# EAGLE design untitled (EAGLE 7.2.0)
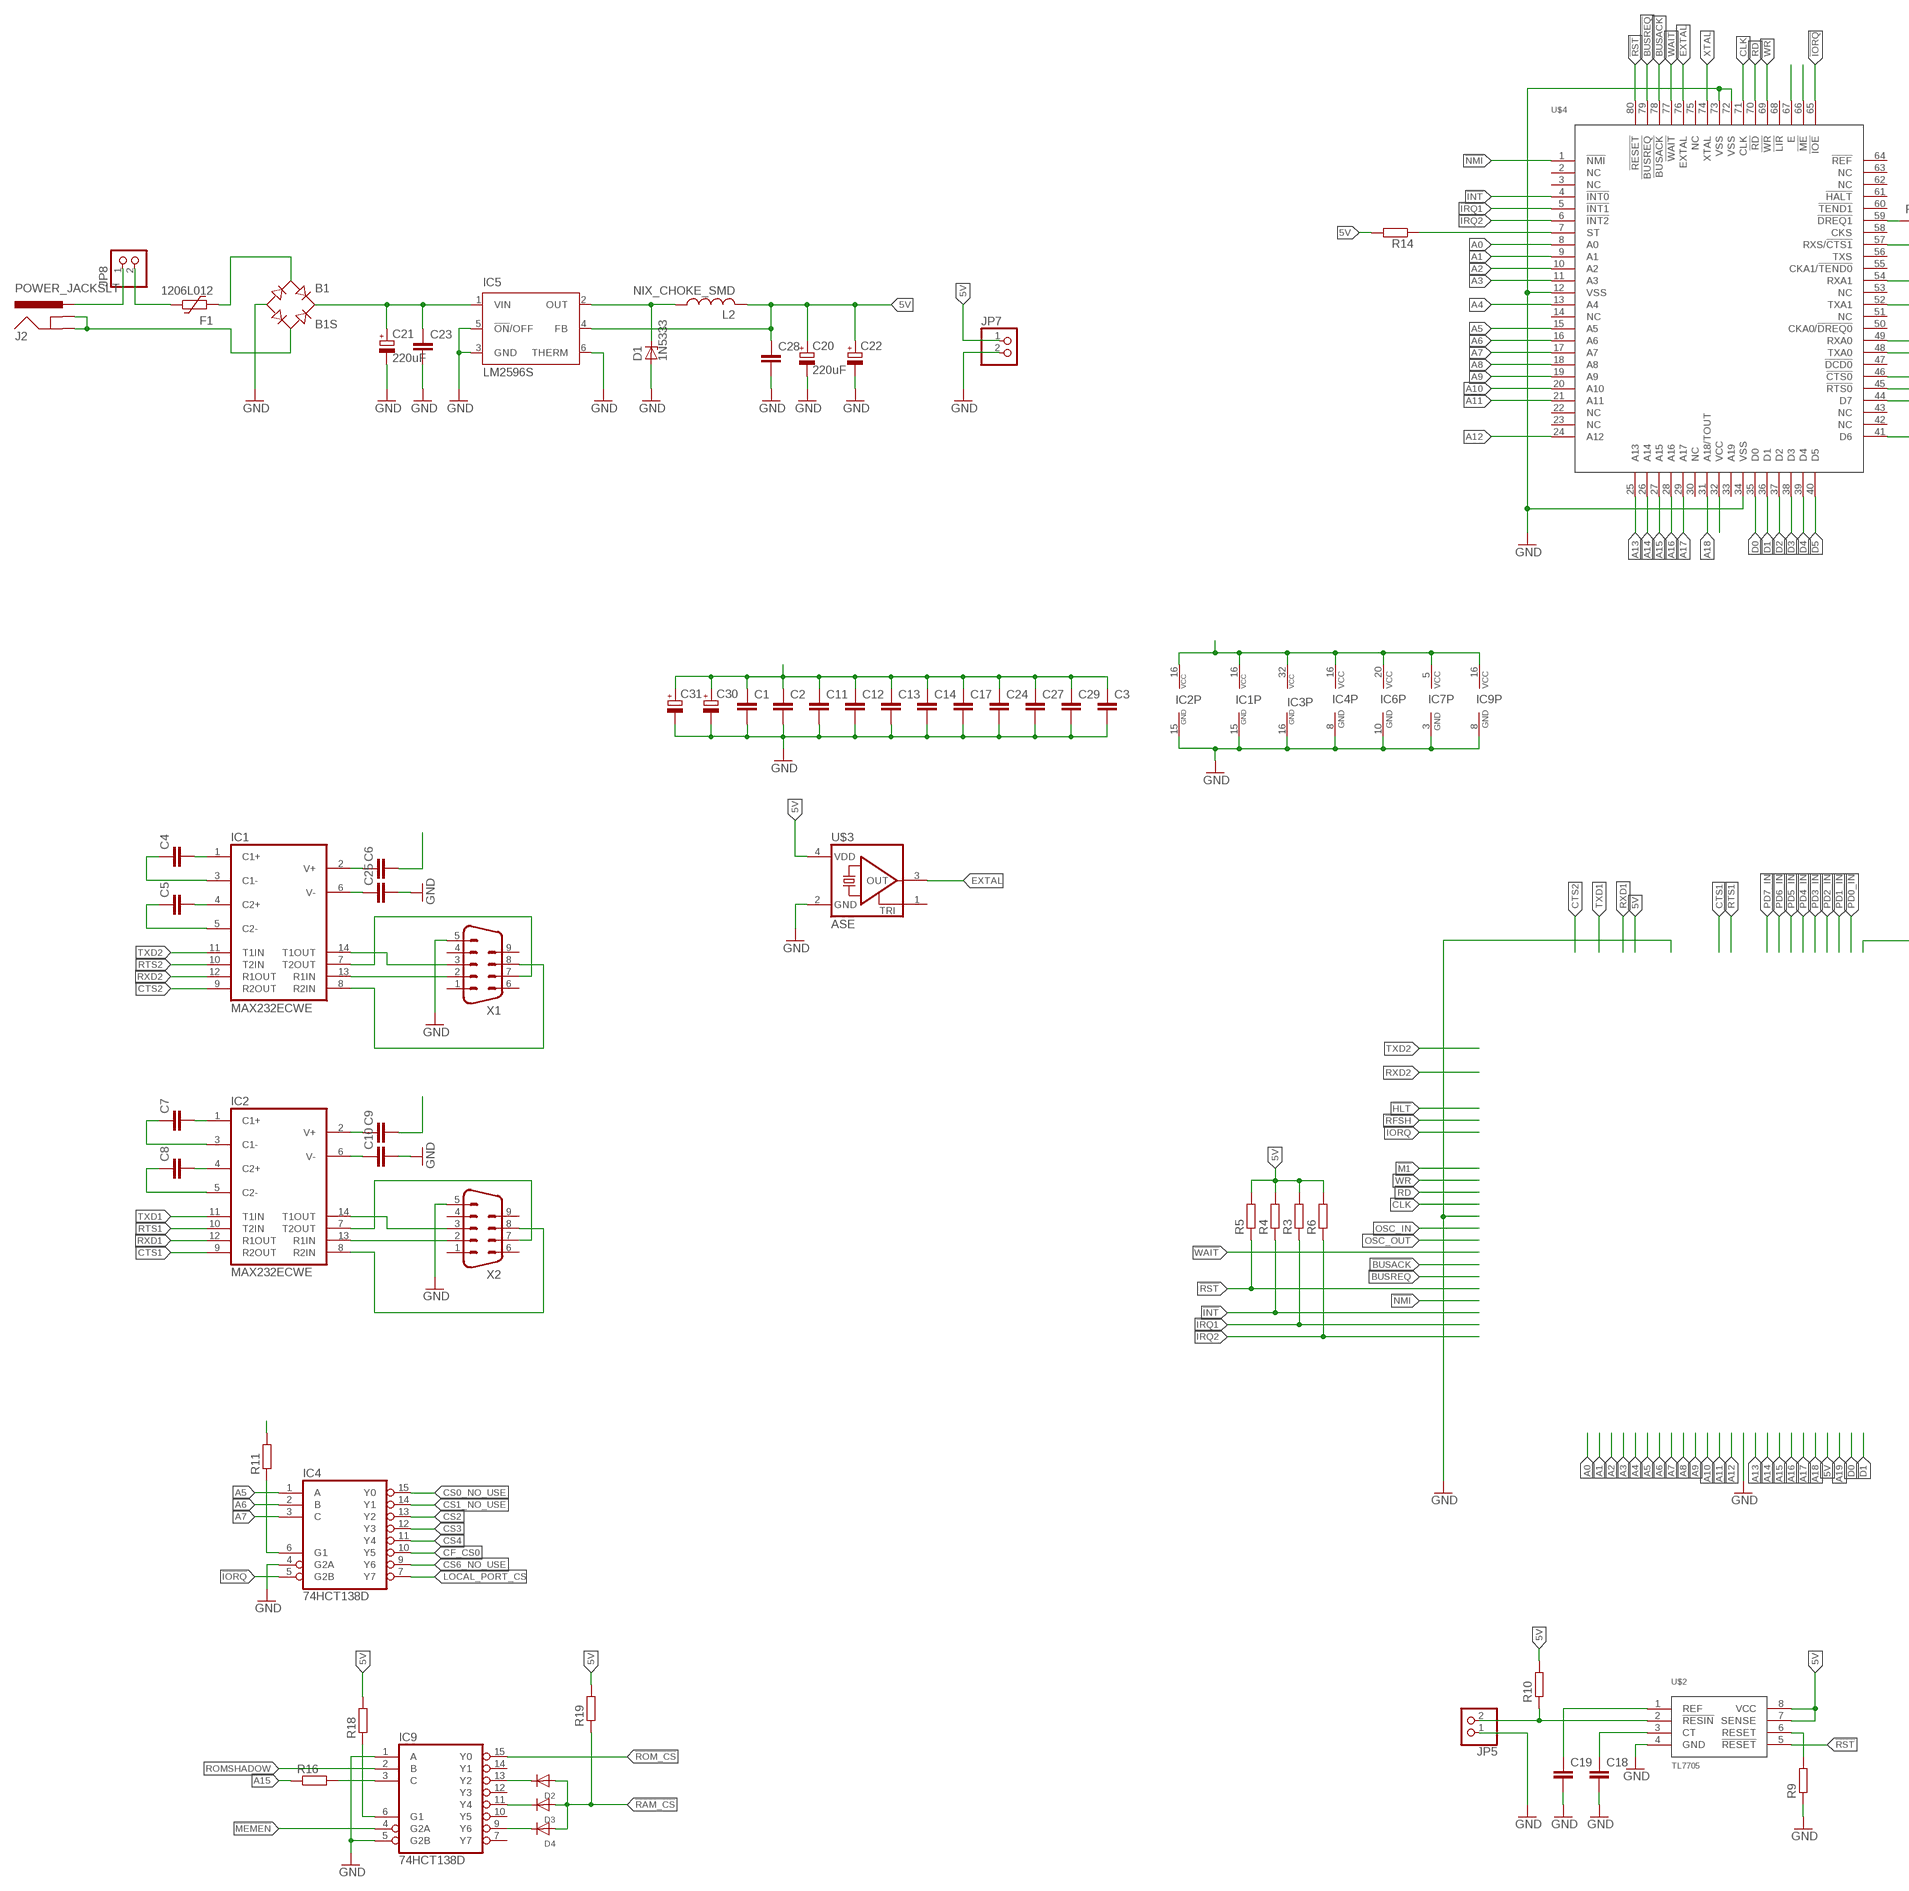
[diagram p0: schematic, sheet 1, part 1 of 2]
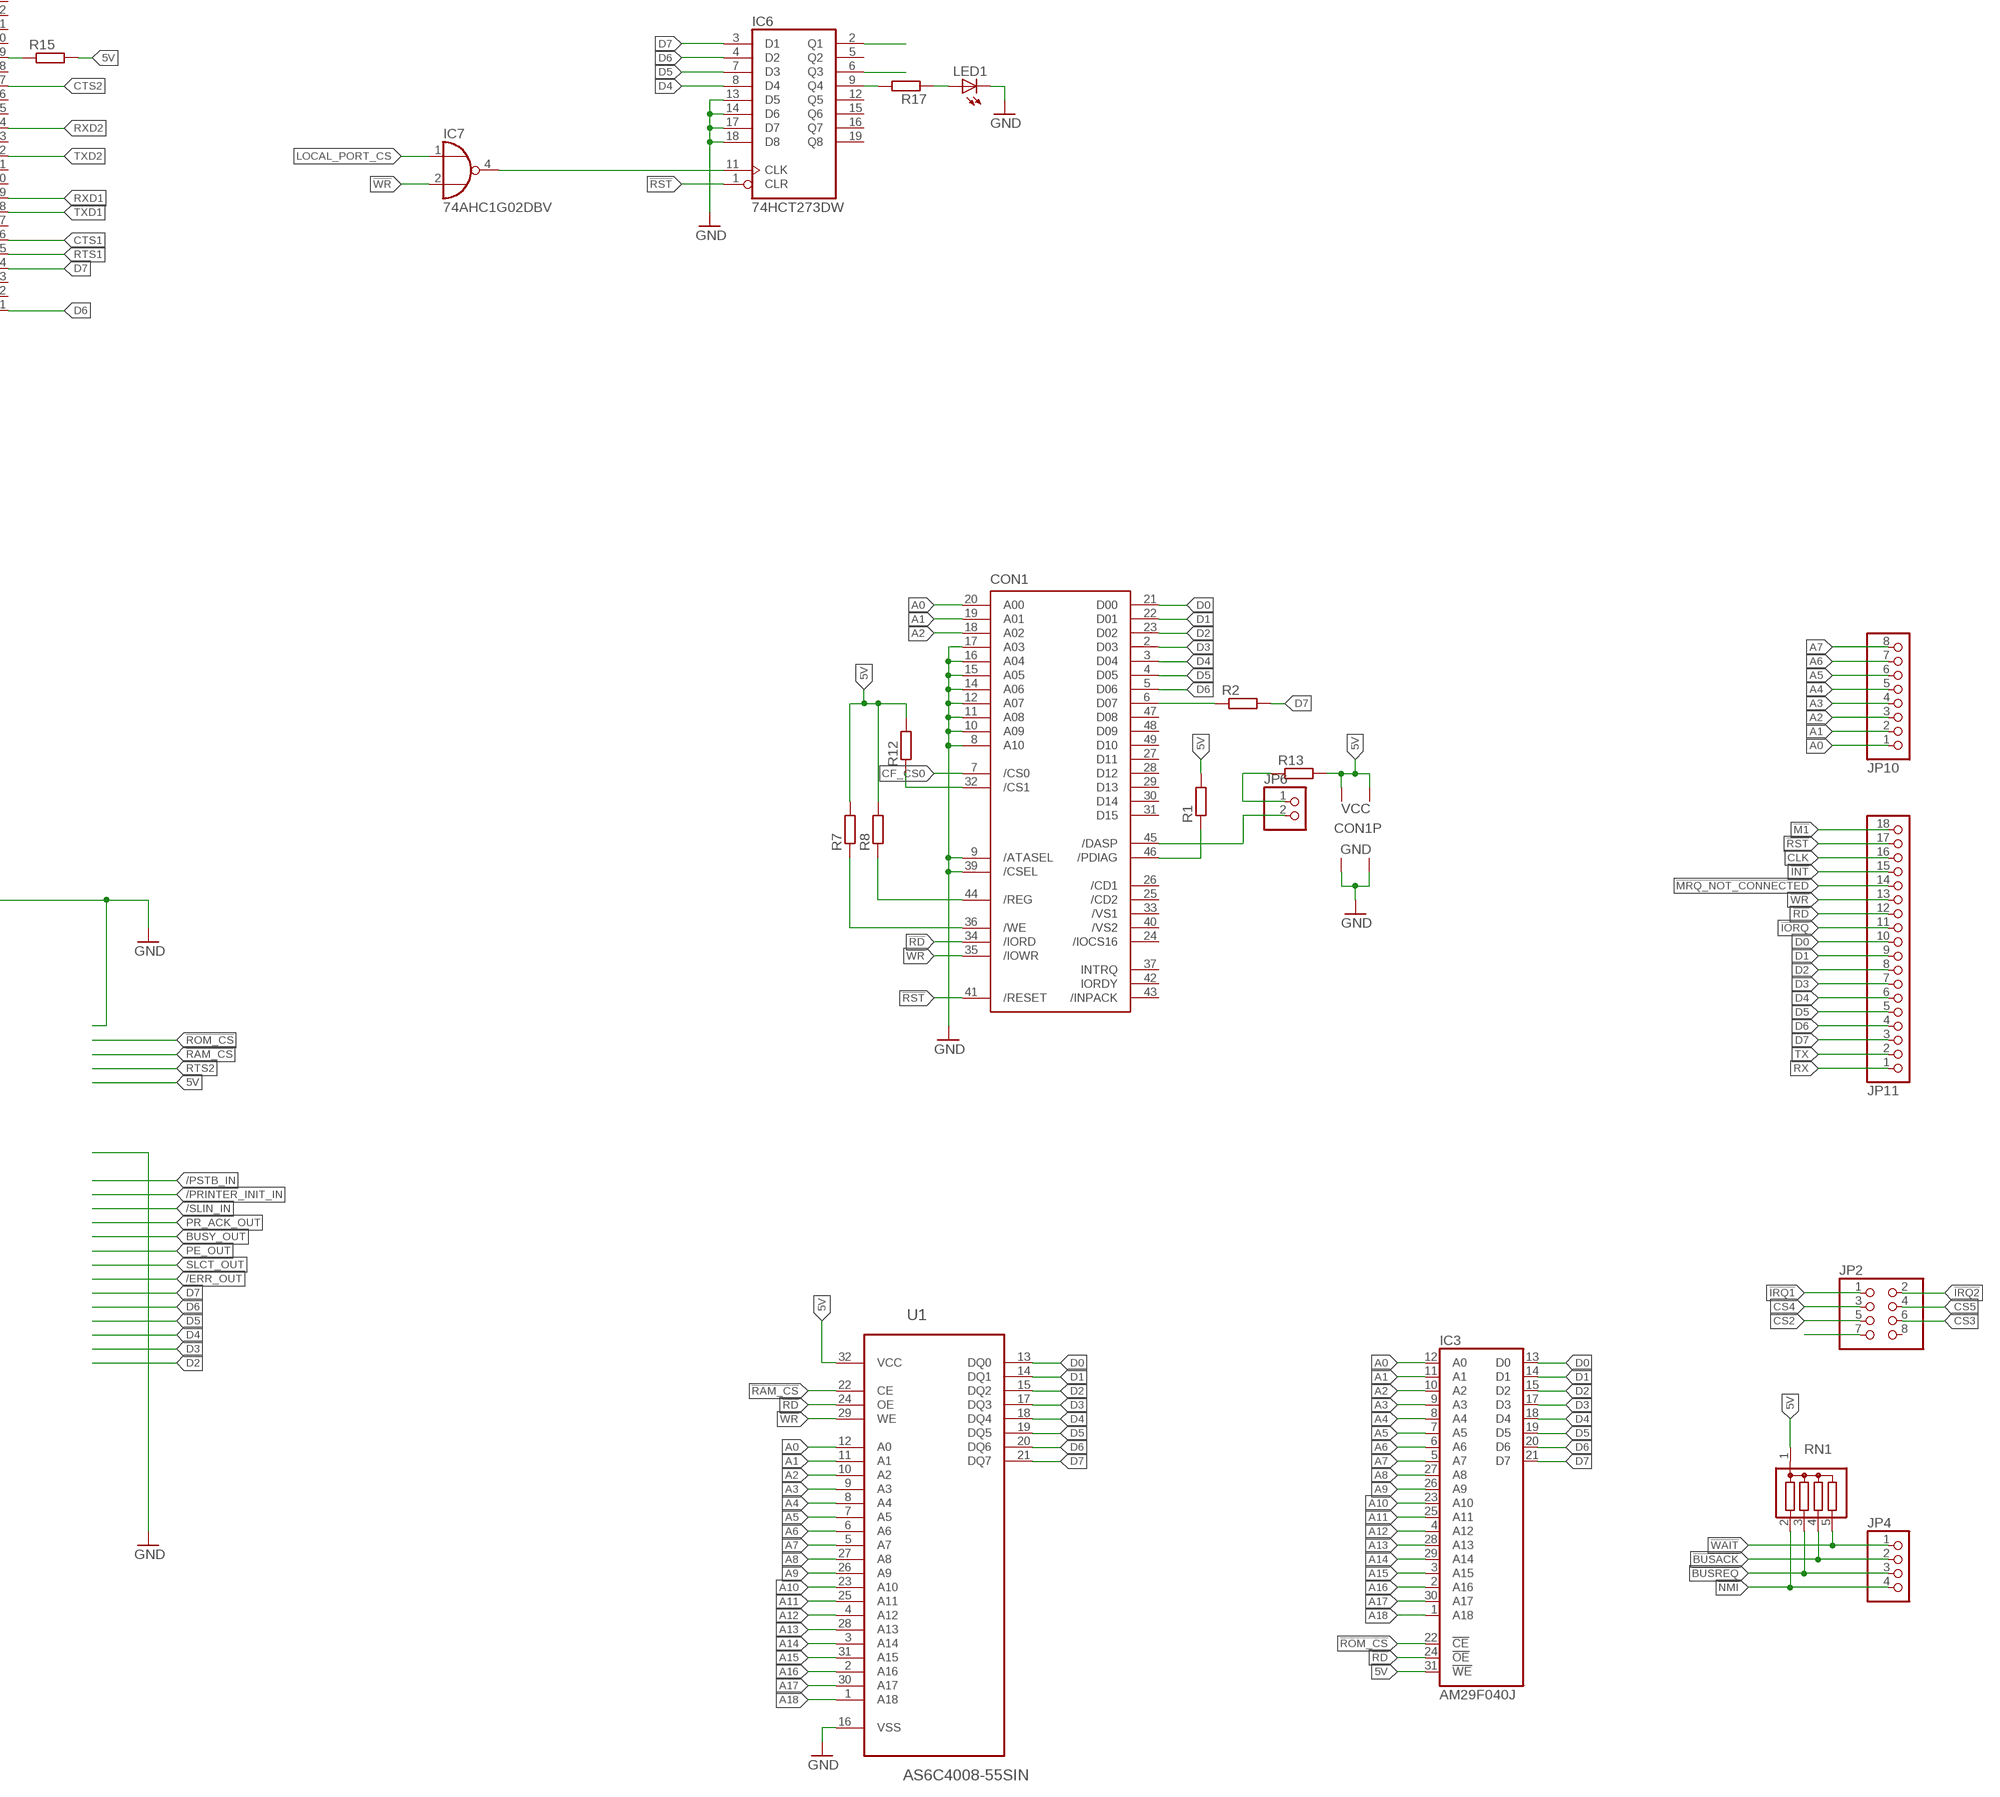
[diagram p1: schematic, sheet 1, part 2 of 2]

## Parts
B1  B1S  [MBS]
C1  C-EUC0603  [C0603]
C2  C-EUC0603  [C0603]
C3  C-EUC0603  [C0603]
C4  C-EUC0603  [C0603]
C5  C-EUC0603  [C0603]
C6  C-EUC0603  [C0603]
C7  C-EUC0603  [C0603]
C8  C-EUC0603  [C0603]
C9  C-EUC0603  [C0603]
C10  C-EUC0603  [C0603]
C11  C-EUC0603  [C0603]
C12  C-EUC0603  [C0603]
C13  C-EUC0402  [C0402]
C14  C-EUC0603  [C0603]
C17  C-EUC0603  [C0603]
C18  C-EUC0603  [C0603]
C19  C-EUC0603  [C0603]
C20  220uF  CPOL-EU153CLV-0810  [153CLV-0810]
C21  220uF  CPOL-EU153CLV-0810  [153CLV-0810]
C22  CPOL-EUSMCC  [SMC_C]
C23  C-EUC0603  [C0603]
C24  C-EUC0603  [C0603]
C25  C-EUC0603  [C0603]
C27  C-EUC0603  [C0603]
C28  C-EUC0603  [C0603]
C29  C-EUC0603  [C0603]
C30  CPOL-EUSMCB  [SMC_B]
C31  CPOL-EUSMCB  [SMC_B]
CON1  CF-CARD-IDE_MODE  [MI20-50PD-SF]
D1  1N5333  [C1702-15]
D2  DIODESOD-323  [SOD-323]
D3  DIODESOD-323  [SOD-323]
D4  DIODESOD-323  [SOD-323]
F1  1206L012  [1206L]
IC1  MAX232ECWE  [SO16L]
IC2  MAX232ECWE  [SO16L]
IC3  AM29F040J  [PLCC32R]
IC4  74HCT138D  [SO16]
IC5  LM2596S  [TO263-5]
IC6  74HCT273DW  [SO20W]
IC7  74AHC1G02DBV  [SOT23-5]
IC9  74HCT138D  [SO16]
J2  POWER_JACKSLT  [POWER_JACK_SLOT]
JP2  PINHD-2X4  [2X04]
JP4  PINHD-1X4  [1X04]
JP5  PINHD-1X2  [1X02]
JP6  PINHD-1X2  [1X02]
JP7  PINHD-1X2  [1X02]
JP8  PINHD-1X2  [1X02]
JP10  PINHD-1X8  [1X08]
JP11  PINHD-1X18  [1X18]
L2  NIX_CHOKE_SMD  [NIX_CHOKE_SMD]
LED1  LEDCHIP-LED0603  [CHIP-LED0603]
R1  R-EU_R0603  [R0603]
R2  R-EU_R0603  [R0603]
R3  R-EU_R0402  [R0402]
R4  R-EU_R0402  [R0402]
R5  R-EU_R1206  [R1206]
R6  R-EU_R0402  [R0402]
R7  R-EU_R0603  [R0603]
R8  R-EU_R0603  [R0603]
R9  R-EU_R0603  [R0603]
R10  R-EU_M1206  [M1206]
R11  R-EU_R0603  [R0603]
R12  R-EU_R0603  [R0603]
R13  R-EU_R0603  [R0603]
R14  R-EU_0204/5  [0204/5]
R15  R-EU_R0603  [R0603]
R16  R-EU_R0603  [R0603]
R17  R-EU_R0603  [R0603]
R18  R-EU_R0603  [R0603]
R19  R-EU_R0603  [R0603]
RN1  G04R  [SIL5]
U1  AS6C4008-55SIN  [SOIC127P1407X299-32N]
U$2  TL7705  [SOIC8]
U$3  ASE  [ASE]
U$4  HD64180QFP80_  [QFP80]
X1  M09HP  [M09HP]
X2  M09HP  [M09HP]

## Nets
5V: C1.1 C2.1 C3.1 C6.2 C9.2 C11.1 C12.1 C13.1 C14.1 C17.1 C20.+ C22.+ C24.1 C27.1 C28.1 C29.1 C30.+ C31.+ CON1.13(VCC2) CON1.38(VCC1) IC1.16(VCC) IC2.16(VCC) IC3.31(!WE) IC3.32(VCC) IC4.16(VCC) IC5.4(FB) IC6.20(VCC) IC7.5(VCC) IC9.16(VCC) JP7.1 L2.P$2 R1.2 R3.2 R4.2 R5.2 R6.2 R7.2 R8.2 R10.2 R11.2 R12.2 R13.2 R14.2 R15.2 R18.2 R19.2 RN1.1 U1.32(VCC) U$2.7(SENSE) U$2.8(VCC) U$3.4(VDD) U$4.32(VCC)
!BUSACK: JP4.2 RN1.4 U$4.78(!BUSACK)
!BUSREQ: JP4.3 RN1.3 U$4.79(!BUSREQ)
!INT: JP11.15 R4.1 U$4.4(!INT0)
!IORQ: IC4.5(G2B) JP11.11 U$4.65(!IOE)
!IRQ1: JP2.1 R3.1 U$4.5(!INT1)
!IRQ2: JP2.2 R6.1 U$4.6(!INT2)
!M1: JP11.18
!MEMEN: IC9.4(G2A) U$4.66(!ME)
!MRQ_NOT_CONNECTED: JP11.14
!NMI: JP4.4 RN1.2 U$4.1(!NMI)
!RAM_CS: D2.A D3.A D4.A R19.1 U1.22(CE)
!RD: CON1.34(/IORD) IC3.24(!OE) JP11.12 U1.24(OE) U$4.70(!RD)
!ROM_CS: IC3.22(!CE) IC9.15(Y0)
!RST: CON1.41(/RESET) IC6.1(CLR) JP11.17 R5.1 U$2.5(!RESET) U$4.80(!RESET)
!WAIT: JP4.1 RN1.5 U$4.77(!WAIT)
!WR: CON1.35(/IOWR) IC7.2(I1) JP11.13 U1.29(WE) U$4.69(!WR)
_A15: IC9.3(C) R16.2
A0: CON1.20(A00) IC3.12(A0) JP10.1 U1.12(A0) U$4.8(A0)
A1: CON1.19(A01) IC3.11(A1) JP10.2 U1.11(A1) U$4.9(A1)
A2: CON1.18(A02) IC3.10(A2) JP10.3 U1.10(A2) U$4.10(A2)
A3: IC3.9(A3) JP10.4 U1.9(A3) U$4.11(A3)
A4: IC3.8(A4) JP10.5 U1.8(A4) U$4.13(A4)
A5: IC3.7(A5) IC4.1(A) JP10.6 U1.7(A5) U$4.15(A5)
A6: IC3.6(A6) IC4.2(B) JP10.7 U1.6(A6) U$4.16(A6)
A7: IC3.5(A7) IC4.3(C) JP10.8 U1.5(A7) U$4.17(A7)
A8: IC3.27(A8) U1.27(A8) U$4.18(A8)
A9: IC3.26(A9) U1.26(A9) U$4.19(A9)
A10: IC3.23(A10) U1.23(A10) U$4.20(A10)
A11: IC3.25(A11) U1.25(A11) U$4.21(A11)
A12: IC3.4(A12) U1.4(A12) U$4.24(A12)
A13: IC3.28(A13) U1.28(A13) U$4.25(A13)
A14: IC3.29(A14) U1.3(A14) U$4.26(A14)
A15: IC3.3(A15) R16.1 U1.31(A15) U$4.27(A15)
A16: IC3.2(A16) U1.2(A16) U$4.28(A16)
A17: IC3.30(A17) U1.30(A17) U$4.29(A17)
A18: IC3.1(A18) U1.1(A18) U$4.31(A18/TOUT)
CF_CS0: CON1.7(/CS0) IC4.10(Y5)
CLK: JP11.16 U$4.71(CLK)
CS0_NO_USE: IC4.15(Y0)
CS1_NO_USE: IC4.14(Y1)
CS2: IC4.13(Y2) JP2.5
CS3: IC4.12(Y3) JP2.6
CS4: IC4.11(Y4) JP2.3
CS5: JP2.4
CS6_NO_USE: IC4.9(Y6)
CTS1: IC2.9(R2OUT) U$4.46(!CTS0)
CTS2: IC1.9(R2OUT) U$4.57(RXS/!CTS1)
D0: CON1.21(D00) IC3.13(D0) JP11.10 U1.13(DQ0) U$4.35(D0)
D1: CON1.22(D01) IC3.14(D1) JP11.9 U1.14(DQ1) U$4.36(D1)
D2: CON1.23(D02) IC3.15(D2) JP11.8 U1.15(DQ2) U$4.37(D2)
D3: CON1.2(D03) IC3.17(D3) JP11.7 U1.17(DQ3) U$4.38(D3)
D4: CON1.3(D04) IC3.18(D4) IC6.8(D4) JP11.6 U1.18(DQ4) U$4.39(D4)
D5: CON1.4(D05) IC3.19(D5) IC6.7(D3) JP11.5 U1.19(DQ5) U$4.40(D5)
D6: CON1.5(D06) IC3.20(D6) IC6.4(D2) JP11.4 U1.20(DQ6) U$4.41(D6)
D7: IC3.21(D7) IC6.3(D1) JP11.3 R2.2 U1.21(DQ7) U$4.44(D7)
E: JP2.7 U$4.67(E)
EXTAL: U$3.3(OUT) U$4.76(EXTAL)
GND: B1.- C1.2 C2.2 C3.2 C10.2 C11.2 C12.2 C13.2 C14.2 C17.2 C18.2 C19.2 C20.- C21.- C22.- C23.2 C24.2 C25.2 C27.2 C28.2 C29.2 C30.- C31.- CON1.1(GND1) CON1.8(A10) CON1.9(/ATASEL) CON1.10(A09) CON1.11(A08) CON1.12(A07) CON1.14(A06) CON1.15(A05) CON1.16(A04) CON1.17(A03) CON1.39(/CSEL) CON1.50(GND2) D1.A IC1.15(GND) IC2.15(GND) IC3.16(GND) IC4.4(G2A) IC4.8(GND) IC5.3(GND) IC5.5(!ON!/OFF) IC5.6(THERM) IC6.10(GND) IC6.13(D5) IC6.14(D6) IC6.17(D7) IC6.18(D8) IC7.3(GND) IC9.1(A) IC9.5(G2B) IC9.8(GND) JP5.1 JP7.2 LED1.C R9.1 U1.16(VSS) U$2.4(GND) U$3.2(GND) U$4.12(VSS) U$4.34(VSS) U$4.72(VSS) U$4.73(VSS) X1.5 X2.5
LOCAL_PORT_CS: IC4.7(Y7) IC7.1(I0)
N$1: IC2.7(T2OUT) X2.7
N$2: C7.2 IC2.1(C1+)
N$3: C8.2 IC2.4(C2+)
N$4: C8.1 IC2.5(C2-)
N$5: C7.1 IC2.3(C1-)
N$6: C9.1 IC2.2(V+)
N$7: IC1.7(T2OUT) X1.7
N$8: IC1.13(R1IN) X1.2
N$9: C4.2 IC1.1(C1+)
N$10: C5.2 IC1.4(C2+)
N$11: C5.1 IC1.5(C2-)
N$12: C4.1 IC1.3(C1-)
N$13: C6.1 IC1.2(V+)
N$14: C25.1 IC1.6(V-)
N$15: IC2.13(R1IN) X2.2
N$16: IC2.14(T1OUT) X2.3
N$17: IC2.8(R2IN) X2.8
N$18: IC1.14(T1OUT) X1.3
N$19: C10.1 IC2.6(V-)
N$20: J2.PWR JP8.1
N$21: B1.AC1 F1.2
N$22: B1.+ C21.+ C23.1 IC5.1(VIN)
N$23: D1.C IC5.2(OUT) L2.P$1
N$24: B1.AC2 J2.GND@1(GNDBREAK) J2.GND@2(GND)
N$25: R15.1 U$4.59(!DREQ1)
N$26: IC4.6(G1) R11.1
N$27: CON1.44(/REG) R8.1
N$28: IC1.8(R2IN) X1.8
N$29: CON1.36(/WE) R7.1
N$30: CON1.46(/PDIAG) R1.1
N$31: CON1.32(/CS1) R12.1
N$32: JP6.1 R13.1
N$33: CON1.45(/DASP) JP6.2
N$34: CON1.6(D07) R2.1
N$35: R9.2 U$2.6(RESET)
N$36: C18.1 U$2.3(CT)
N$37: C19.1 U$2.1(REF)
N$38: JP5.2 R10.1 U$2.2(!RESIN)
N$39: F1.1 JP8.2
N$44: IC6.11(CLK) IC7.4(O)
N$46: IC6.9(Q4) R17.2
N$47: LED1.A R17.1
N$48: IC9.6(G1) R18.1
N$49: D2.C IC9.13(Y2)
N$50: D4.C IC9.9(Y6)
N$51: D3.C IC9.11(Y4)
ROMSHADOW: IC6.6(Q3) IC9.2(B)
RTS1: IC2.10(T2IN) U$4.45(!RTS0)
RTS2: IC1.10(T2IN) IC6.2(Q1)
RX: JP11.1
RXD1: IC2.12(R1OUT) U$4.49(RXA0)
RXD2: IC1.12(R1OUT) U$4.54(RXA1)
ST: R14.1 U$4.7(ST)
TX: JP11.2
TXD1: IC2.11(T1IN) U$4.48(TXA0)
TXD2: IC1.11(T1IN) U$4.52(TXA1)
XTAL: U$4.74(XTAL)
Unconnected: CON1.24(/IOCS16) CON1.25(/CD2) CON1.26(/CD1) CON1.27(D11) CON1.28(D12) CON1.29(D13) CON1.30(D14) CON1.31(D15) CON1.33(/VS1) CON1.37(INTRQ) CON1.40(/VS2) CON1.42(IORDY) CON1.43(/INPACK) CON1.47(D08) CON1.48(D09) CON1.49(D10) IC6.5(Q2) IC6.12(Q5) IC6.15(Q6) IC6.16(Q7) IC6.19(Q8) IC9.7(Y7) IC9.10(Y5) IC9.12(Y3) IC9.14(Y1) JP2.8 U$3.1(TRI) U$4.2(NC) U$4.3(NC) U$4.14(NC) U$4.22(NC) U$4.23(NC) U$4.30(NC) U$4.33(A19) U$4.42(NC) U$4.43(NC) U$4.47(!DCD0) U$4.50(CKA0/!DREQ0) U$4.51(NC) U$4.53(NC) U$4.55(CKA1/!TEND0) U$4.56(TXS) U$4.58(CKS) U$4.60(!TEND1) U$4.61(!HALT) U$4.62(NC) U$4.63(NC) U$4.64(!REF) U$4.68(!LIR) U$4.75(NC) X1.1 X1.4 X1.6 X1.9 X2.1 X2.4 X2.6 X2.9

## Library data of the parts
B1 = rectifier:B*S: Surface Mount Glass Passivated Bridge Rectifiers Source: Comchip Bridge Rectifiers B05S-G_B10S-G.pdf
C1-C14 C17-C19 C23-C25 C27-C29 = rcl:C-EU: CAPACITOR, European symbol
C20-C22 C30 C31 = rcl:CPOL-EU: POLARIZED CAPACITOR, European symbol
CON1 = con-hirose:CF-CARD-IDE_MODE: Compact Flash Adapter Type I or II without Eject Button Source: con-hirose.lbr from Bob Starr <rtzaudio@mindspring.com>; OC_FARNELL: unknown; OC_NEWARK: unknown
D1 = diode:1N5333: Z DIODE 3.3 V, 5W, 5 percent (Motorola)
D2-D4 = adafruit:DIODE: Diode SMADIODE - SMA Surface Mount Package 20V 1A Schottky Diode Digikey: 641-1014-6-ND DO-1N4148 - Through Hole Small Current Diode SOD-123 20V 1 A (.5mV Vf) Schottky Diode - Digikey: MBRX120TPMSCT-ND SOD-323 10V 570mA (.38mV Vf, 3ns) Schottky Diode - Digikey: ZLLS410CT-ND SOD-523 30V 30mA Schottky Diode (RB751S-40TE61) - Digikey: RB751S-40TE61CT-ND SOT23-R/W - SOT23 Package (R = Solder Paste/Reflow Ovens, W = Hand-Soldering) BAT54Film 40V 300mA - Digikey: 497-7162-1-ND
F1 = polyfuse-smd_10:?: Polyfuse Resettable PTC Source: http://www.littelfuse.com/products/resettable-ptcs.aspx; MF: Littelfuse; MPN: 1206L012; OC_FARNELL: 1596988; OC_NEWARK: 05M2298
IC1 IC2 = maxim:MAX232ECWE: RS232 TRANSCEIVER; MF: MAXIM; MPN: MAX232ECWE+; OC_FARNELL: 9724435; OC_NEWARK: 67K4440
IC3 = am29-memory:AM29F040J: 4-Megabit FLASH MEMORY (512 K x 8 bit) 5 V-only
IC4 IC9 = 74xx-eu:74*138: 3-line to 8-line DECODER/DEMULTIPLEXER
IC5 = mw:LM2596: SIMPLE SWITCHER® Power Converter 150 kHz 3A Step-Down Voltage Regulator Source: http://www.national.com/ds/LM/LM2596.pdf; MF: NATIONAL SEMICONDUCTOR; MPN: LM2596S-ADJ/NOPB; OC_FARNELL: 9494367; OC_NEWARK: 41K3842
IC6 = 74xx-eu:74*273: Octal D type FLIP FLOP, clear
IC7 = 74xx-little-de:74*1G02: 2-input NOR gate
J2 = SparkFun-Connectors:POWER_JACK: Power Jack This is the standard 5.5mm barrel jack for power. The PTH is the most common, proven, reliable, footprint. The Slot footprint only works if the mill layer is transmitted to the PCB fab house so be warned. Mating wall wart : TOL-00298 (and others); PROD_ID: PRT-00119
JP2 = pinhead:PINHD-2X4: PIN HEADER
JP4 = pinhead:PINHD-1X4: PIN HEADER
JP5-JP8 = pinhead:PINHD-1X2: PIN HEADER
JP10 = pinhead:PINHD-1X8: PIN HEADER
JP11 = pinhead:PINHD-1X18: PIN HEADER
L2 = mw:NIX_CHOKE_SMD
LED1 = led:LED: LED OSRAM: - CHIPLED LG R971, LG N971, LY N971, LG Q971, LY Q971, LO R971, LY R971 LH N974, LH R974 LS Q976, LO Q976, LY Q976 LO Q996 - Hyper CHIPLED LW Q18S LB Q993, LB Q99A, LB R99A - SideLED LS A670, LO A670, LY A670, LG A670, LP A670 LB A673, LV A673, LT A673, LW A673 LH A674 LY A675 LS A676, LA A676, LO A676, LY A676, LW A676 LS A679, LY A679, LG A679 - Hyper Micro SIDELED® LS Y876, LA Y876, LO Y876, LY Y876 LT Y87S - SmartLED LW L88C, LW L88S LB L89C, LB L89S, LG L890 LS L89K, LO L89K, LY L89K LS L896, LA L896, LO L896, LY L896 - TOPLED LS T670, LO T670, LY T670, LG T670, LP T670 LSG T670, LSP T670, LSY T670, LOP T670, LYG T670 LG T671, LOG T671, LSG T671 LB T673, LV T673, LT T673, LW T673 LH T674 LS T676, LA T676, LO T676, LY T676, LB T676, LH T676, LSB T676, LW T676 LB T67C, LV T67C, LT T67C, LS T67K, LO T67K, LY T67K, LW E67C LS E67B, LA E67B, LO E67B, LY E67B, LB E67C, LV E67C, LT E67C LW T67C LS T679, LY T679, LG T679 LS T770, LO T770, LY T770, LG T770, LP T770 LB T773, LV T773, LT T773, LW T773 LH T774 LS E675, LA E675, LY E675, LS T675 LS T776, LA T776, LO T776, LY T776, LB T776 LHGB T686 LT T68C, LB T68C - Hyper Mini TOPLED® LB M676 - Mini TOPLED Santana® LG M470 LS M47K, LO M47K, LY M47K Source: http://www.osram.convergy.de LUXEON: - LUMILED® LXK2-PW12-R00, LXK2-PW12-S00, LXK2-PW14-U00, LXK2-PW14-V00 LXK2-PM12-R00, LXK2-PM12-S00, LXK2-PM14-U00 LXK2-PE12-Q00, LXK2-PE12-R00, LXK2-PE12-S00, LXK2-PE14-T00, LXK2-PE14-U00 LXK2-PB12-K00, LXK2-PB12-L00, LXK2-PB12-M00, LXK2-PB14-N00, LXK2-PB14-P00, LXK2-PB14-Q00 LXK2-PR12-L00, LXK2-PR12-M00, LXK2-PR14-Q00, LXK2-PR14-R00 LXK2-PD12-Q00, LXK2-PD12-R00, LXK2-PD12-S00 LXK2-PH12-R00, LXK2-PH12-S00 LXK2-PL12-P00, LXK2-PL12-Q00, LXK2-PL12-R00 Source: www.luxeon.com KINGBRIGHT: KA-3528ASYC Source: www.kingbright.com
R1-R19 = rcl:R-EU_: RESISTOR, European symbol
RN1 = resistor-sil:G04R: SIL RESISTOR; OC_FARNELL: unknown; OC_NEWARK: unknown
U1 = Alliance_Memory_By_element14_Batch_1:AS6C4008-55SIN: CMOS SRAM; MPN: AS6C4008-55SIN; OC_FARNELL: 1562901; OC_NEWARK: 94M6218; PACKAGE: SO-32; SUPPLIER: ALLIANCE MEMORY
U$2 = mw:TL7705
U$3 = crystal:ASE: 3.3Vdc CMOS SMD CRYSTAL CLOCK OSCILLATOR SOurce: www.abracon.com; OC_FARNELL: unknown; OC_NEWARK: unknown
U$4 = mw:HD64180
X1 X2 = con-subd:M09: SUB-D; OC_FARNELL: unknown; OC_NEWARK: unknown

## Board
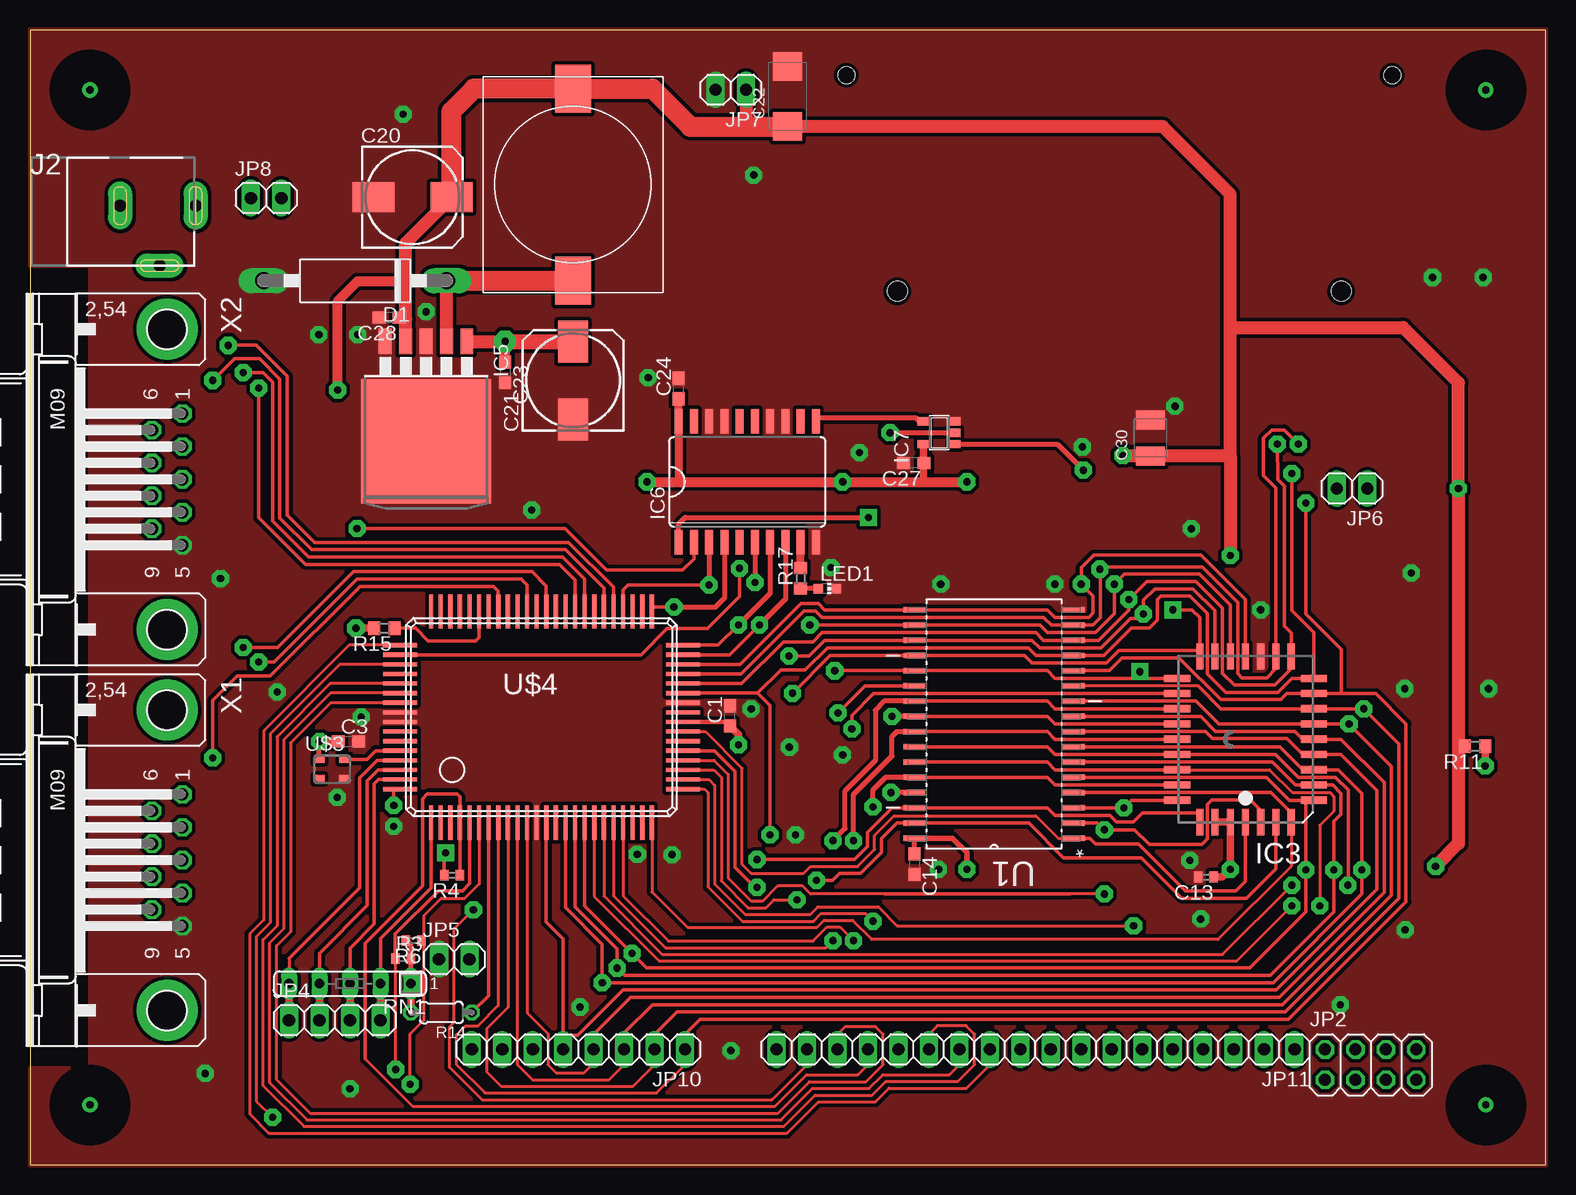
[diagram p2: board, top side]
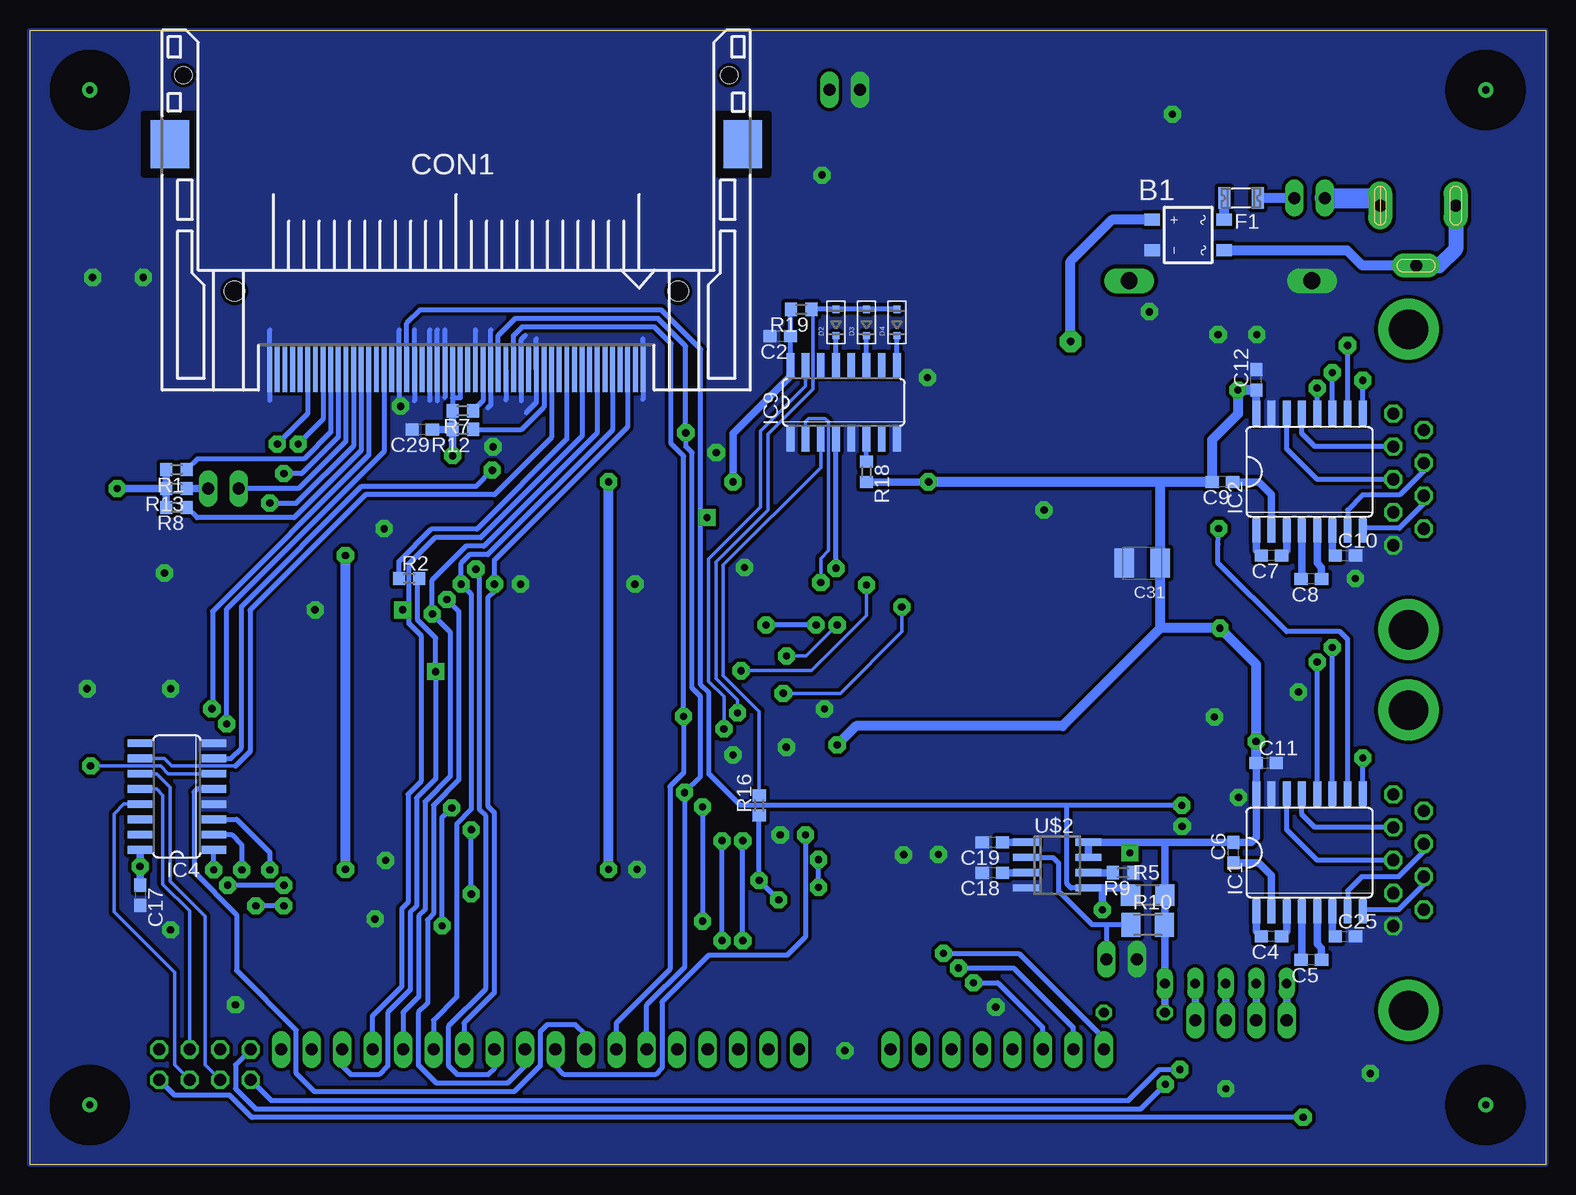
[diagram p3: board, bottom side, seen from below]

Size 126.34 x 94.61 mm. Coordinates in mm from the lower left corner, seen from the top.
Outline: 0,0 126.34,0 126.34,94.61 0,94.61 0,0
Copper layers (1*16): Top 0.035mm / dielectric 1.5mm / Bottom 0.035mm
Design rules "default *": minimum track width 10mil, minimum drill 24mil, track to track 8mil, track to pad 8mil, pad to pad 8mil, via to via 8mil, smd to smd 8mil, copper to edge 0mil, drill to drill 8mil, minimum pad ring 10mil, minimum via ring 8mil, stop-mask expansion 4mil, vias tented up to drill 0mil, thermal gap 10mil
tRestrict: area 2,2 to 8,8; area 118.3,2 to 124.4,8; area 2,86.6 to 8,92.7; area 118.3,86.6 to 124.4,92.7
bRestrict: area 75.7,64.4 to 105.9,68.2; area 2,2 to 8,8; area 118.3,2 to 124.4,8; area 2,86.6 to 8,92.7; area 118.3,86.6 to 124.4,92.7

### Footprints (pad centres in the part's own frame; a part is rotated, then mirrored left to right if it is on the bottom)
MBS = smd 1 x 1.3: + -1.27,-3; - 1.27,-3; AC1 -1.27,3; AC2 1.27,3
C0603 = smd 1.1 x 1: 1 -0.85,0; 2 0.85,0
C0402 = smd 0.7 x 0.9: 1 -0.65,0; 2 0.65,0
153CLV-0810 = smd 3.5 x 2.5: + 3.25,0; - -3.25,0
SMC_C = smd 2.4 x 2.4: + -2.5,0; - 2.5,0
SMC_B = smd 1.6 x 2.4: + -1.5,0; - 1.5,0
MI20-50PD-SF = smd 0.41 x 3.75: 1 15.557,-18.78; 2 14.287,-18.78; 3 13.018,-18.78; 4 11.748,-18.78; 5 10.477,-18.78; 6 9.207,-18.78; 7 7.938,-18.78; 8 6.668,-18.78; 9 5.397,-18.78; 10 4.128,-18.78; 11 2.857,-18.78; 12 1.587,-18.78; 13 0.318,-18.78; 14 -0.953,-18.78; 15 -2.223,-18.78; 16 -3.493,-18.78; 17 -4.763,-18.78; 18 -6.032,-18.78; 19 -7.303,-18.78; 20 -8.572,-18.78; 21 -9.842,-18.78; 22 -11.113,-18.78; 23 -12.383,-18.78; 24 -13.652,-18.78; 25 -14.922,-18.78; 26 14.922,-18.78; 27 13.652,-18.78; 28 12.383,-18.78; 29 11.113,-18.78; 30 9.842,-18.78; 31 8.572,-18.78; 32 7.303,-18.78; 33 6.032,-18.78; 34 4.763,-18.78; 35 3.493,-18.78; 36 2.223,-18.78; 37 0.953,-18.78; 38 -0.318,-18.78; 39 -1.587,-18.78; 40 -2.857,-18.78; 41 -4.128,-18.78; 42 -5.397,-18.78; 43 -6.668,-18.78; 44 -7.938,-18.78; 45 -9.207,-18.78; 46 -10.477,-18.78; 47 -11.748,-18.78; 48 -13.018,-18.78; 49 -14.287,-18.78; 50 -15.557,-18.78 | smd 3.2 x 4: M1 -23.883,-0.005; M2 23.883,-0.005 | hole 1.676: 18.5,-12.25; -18.5,-12.25 | hole 1.422: -22.75,5.75; 22.75,5.75
C1702-15 = drill 1.397 long: A 7.62,0; C -7.62,0
SOD-323 = smd 0.6 x 0.6: A 1.1,0; C -1.1,0
1206L = smd 1 x 1.8: 1 -1.4,0; 2 1.4,0
SO16L = smd 0.66 x 2.032: 1 -4.445,-4.902; 2 -3.175,-4.902; 3 -1.905,-4.902; 4 -0.635,-4.902; 5 0.635,-4.902; 6 1.905,-4.902; 7 3.175,-4.902; 8 4.445,-4.902; 9 4.445,4.902; 10 3.175,4.902; 11 1.905,4.902; 12 0.635,4.902; 13 -0.635,4.902; 14 -1.905,4.902; 15 -3.175,4.902; 16 -4.445,4.902
PLCC32R = smd 0.6 x 2.2: 1 0,6.9; 2 -1.27,6.9; 3 -2.54,6.9; 4 -3.81,6.9; 14 -3.81,-6.9; 15 -2.54,-6.9; 16 -1.27,-6.9; 17 0,-6.9; 18 1.27,-6.9; 19 2.54,-6.9; 20 3.81,-6.9; 30 3.81,6.9; 31 2.54,6.9; 32 1.27,6.9 | smd 2.2 x 0.6: 5 -5.7,5.08; 6 -5.7,3.81; 7 -5.7,2.54; 8 -5.7,1.27; 9 -5.7,0; 10 -5.7,-1.27; 11 -5.7,-2.54; 12 -5.7,-3.81; 13 -5.7,-5.08; 21 5.7,-5.08; 22 5.7,-3.81; 23 5.7,-2.54; 24 5.7,-1.27; 25 5.7,0; 26 5.7,1.27; 27 5.7,2.54; 28 5.7,3.81; 29 5.7,5.08
SO16 = smd 0.66 x 2.032: 1 -4.445,-3.073; 2 -3.175,-3.073; 3 -1.905,-3.073; 4 -0.635,-3.073; 5 0.635,-3.073; 6 1.905,-3.073; 7 3.175,-3.073; 8 4.445,-3.073; 9 4.445,3.073; 10 3.175,3.073; 11 1.905,3.073; 12 0.635,3.073; 13 -0.635,3.073; 14 -1.905,3.073; 15 -3.175,3.073; 16 -4.445,3.073
TO263-5 = smd 1.067 x 2.159: 1 -3.404,-5.791; 2 -1.702,-5.791; 3 0,-5.791; 4 1.702,-5.791; 5 3.404,-5.791 | smd 10.8 x 10.41: 6 0,2.54
SO20W = smd 0.66 x 2.032: 1 -5.715,-5.029; 2 -4.445,-5.029; 3 -3.175,-5.029; 4 -1.905,-5.029; 5 -0.635,-5.029; 6 0.635,-5.029; 7 1.905,-5.029; 8 3.175,-5.029; 9 4.445,-5.029; 10 5.715,-5.029; 11 5.715,5.029; 12 4.445,5.029; 13 3.175,5.029; 14 1.905,5.029; 15 0.635,5.029; 16 -0.635,5.029; 17 -1.905,5.029; 18 -3.175,5.029; 19 -4.445,5.029; 20 -5.715,5.029
SOT23-5 = smd 0.69 x 0.99: 1 -0.95,-1.29; 2 0,-1.29; 3 0.95,-1.29; 4 0.95,1.3; 5 -0.95,1.3
POWER_JACK_SLOT = drill 1 pad 2 long: GND@1 2.58,7.5; GND@2 7.58,10.8; PWR 2.58,13.8
2X04 = drill 1.016 octagon: 1 -3.81,-1.27; 2 -3.81,1.27; 3 -1.27,-1.27; 4 -1.27,1.27; 5 1.27,-1.27; 6 1.27,1.27; 7 3.81,-1.27; 8 3.81,1.27
1X04 = drill 1.016 long: 1 -3.81,0; 2 -1.27,0; 3 1.27,0; 4 3.81,0
1X02 = drill 1.016 long: 1 -1.27,0; 2 1.27,0
1X08 = drill 1.016 long: 1 -8.89,0; 2 -6.35,0; 3 -3.81,0; 4 -1.27,0; 5 1.27,0; 6 3.81,0; 7 6.35,0; 8 8.89,0
1X18 = drill 1.016 long: 1 -21.59,0; 2 -19.05,0; 3 -16.51,0; 4 -13.97,0; 5 -11.43,0; 6 -8.89,0; 7 -6.35,0; 8 -3.81,0; 9 -1.27,0; 10 1.27,0; 11 3.81,0; 12 6.35,0; 13 8.89,0; 14 11.43,0; 15 13.97,0; 16 16.51,0; 17 19.05,0; 18 21.59,0
NIX_CHOKE_SMD = smd 4 x 3: P$1 1,7.5; P$2 17,7.5
CHIP-LED0603 = smd 0.8 x 0.8: A 0,-0.75; C 0,0.75
R0603 = smd 1 x 1.1: 1 -0.85,0; 2 0.85,0
R0402 = smd 0.7 x 0.9: 1 -0.65,0; 2 0.65,0
R1206 = smd 1.6 x 1.803: 1 -1.422,0; 2 1.422,0
M1206 = smd 1.6 x 2: 1 -1.4,0; 2 1.4,0
0204/5 = drill 0.813 octagon: 1 -2.54,0; 2 2.54,0
SIL5 = drill 0.813 long: 1 -5.08,0; 2 -2.54,0; 3 0,0; 4 2.54,0; 5 5.08,0
SOIC127P1407X299-32N = smd 1.803 x 0.457: 1 -6.655,9.525; 2 -6.655,8.255; 3 -6.655,6.985; 4 -6.655,5.715; 5 -6.655,4.445; 6 -6.655,3.175; 7 -6.655,1.905; 8 -6.655,0.635; 9 -6.655,-0.635; 10 -6.655,-1.905; 11 -6.655,-3.175; 12 -6.655,-4.445; 13 -6.655,-5.715; 14 -6.655,-6.985; 15 -6.655,-8.255; 16 -6.655,-9.525; 17 6.655,-9.525; 18 6.655,-8.255; 19 6.655,-6.985; 20 6.655,-5.715; 21 6.655,-4.445; 22 6.655,-3.175; 23 6.655,-1.905; 24 6.655,-0.635; 25 6.655,0.635; 26 6.655,1.905; 27 6.655,3.175; 28 6.655,4.445; 29 6.655,5.715; 30 6.655,6.985; 31 6.655,8.255; 32 6.655,9.525
SOIC8 = smd 0.6 x 2.2: 1 -1.905,-2.6; 2 -0.635,-2.6; 3 0.635,-2.6; 4 1.905,-2.6; 5 1.905,2.6; 6 0.635,2.6; 7 -0.635,2.6; 8 -1.905,2.6
ASE = smd 0.9 x 0.65: 1 -1.05,-0.825; 2 1.05,-0.825; 3 1.05,0.825; 4 -1.05,0.825
QFP80 = smd 0.35 x 2.85: 1 -8.8,-8.326; 2 -8,-8.326; 3 -7.2,-8.326; 4 -6.4,-8.326; 5 -5.6,-8.326; 6 -4.8,-8.326; 7 -4,-8.326; 8 -3.2,-8.326; 9 -2.4,-8.326; 10 -1.6,-8.326; 11 -0.8,-8.326; 12 0,-8.326; 13 0.8,-8.326; 14 1.6,-8.326; 15 2.4,-8.326; 16 3.2,-8.326; 17 4,-8.326; 18 4.8,-8.326; 19 5.6,-8.326; 20 6.4,-8.326; 21 7.2,-8.326; 22 8,-8.326; 23 8.8,-8.326; 24 9.6,-8.326; 41 9.6,9.271; 42 8.8,9.271; 43 8,9.271; 44 7.2,9.271; 45 6.4,9.271; 46 5.6,9.271; 47 4.8,9.271; 48 4,9.271; 49 3.2,9.271; 50 2.4,9.271; 51 1.6,9.271; 52 0.8,9.271; 53 0,9.271; 54 -0.8,9.271; 55 -1.6,9.271; 56 -2.4,9.271; 57 -3.2,9.271; 58 -4,9.271; 59 -4.8,9.271; 60 -5.6,9.271; 61 -6.4,9.271; 62 -7.2,9.271; 63 -8,9.271; 64 -8.8,9.271 | smd 2.85 x 0.35: 25 12.195,-5.53; 26 12.195,-4.73; 27 12.195,-3.93; 28 12.195,-3.13; 29 12.195,-2.33; 30 12.195,-1.53; 31 12.195,-0.73; 32 12.195,0.07; 33 12.195,0.87; 34 12.195,1.67; 35 12.195,2.47; 36 12.195,3.27; 37 12.195,4.07; 38 12.195,4.87; 39 12.195,5.67; 40 12.195,6.47; 65 -11.395,6.47; 66 -11.395,5.67; 67 -11.395,4.87; 68 -11.395,4.07; 69 -11.395,3.27; 70 -11.395,2.47; 71 -11.395,1.67; 72 -11.395,0.87; 73 -11.395,0.07; 74 -11.395,-0.73; 75 -11.395,-1.53; 76 -11.395,-2.33; 77 -11.395,-3.13; 78 -11.395,-3.93; 79 -11.395,-4.73; 80 -11.395,-5.53
M09HP = drill 1.016 octagon: 1 -5.486,1.27; 2 -2.743,1.27; 3 0,1.27; 4 2.743,1.27; 5 5.486,1.27; 6 -4.115,-1.27; 7 -1.372,-1.27; 8 1.372,-1.27; 9 4.115,-1.27 | drill 3.302 pad 5.08: G1 -12.522,0; G2 12.522,0

### Placement (x,y rotation side)
B1  29.8,77.52 270 bottom
C1  58.34,37.44 90 top
C2  63.8,69.09 180 bottom
C3  26.54,35.29 0 top
C4  22.86,19.05 180 bottom
C5  19.53,17.09 180 bottom
C6  26.04,26.04 90 bottom
C7  22.86,50.8 180 bottom
C8  19.53,48.84 180 bottom
C9  26.95,56.95 180 bottom
C10  16.69,50.8 0 bottom
C11  23.29,33.5 0 bottom
C12  24.13,65.46 90 bottom
C13  98.03,24 180 top
C14  73.71,25.07 270 top
C17  117.17,22.48 270 bottom
C18  46.13,24.36 180 bottom
C19  46.13,26.9 180 bottom
C20  31.88,80.67 0 top
C21  45.26,65.41 90 top
C22  63.14,89.08 90 top
C23  39.6,66.07 270 top
C24  54.08,64.72 90 top
C25  16.69,19.05 0 bottom
C27  73.66,58.52 180 top
C28  29.95,70.64 180 top
C29  93.65,61.32 180 bottom
C30  93.4,60.6 90 top
C31  33.63,50.16 180 bottom
CON1  90.81,85.09 0 bottom
D1  27.1,73.71 180 top
D2  59.16,70.23 90 bottom
D3  56.62,70.23 90 bottom
D4  54.08,70.23 90 bottom
F1  25.4,80.61 180 bottom
IC1  19.68,26.04 0 bottom
IC2  19.68,57.78 0 bottom
IC3  101.32,35.48 180 top
IC4  114.1,30.71 90 bottom
IC5  33.02,62.87 180 top
IC6  59.79,56.95 0 top
IC7  75.79,61.04 90 top
IC9  58.52,63.58 0 bottom
J2  0,82.55 270 top
JP2  111.76,8.36 0 top
JP4  25.4,12.06 0 top
JP5  35.36,17.14 0 top
JP6  110.21,56.39 180 top
JP7  58.42,89.64 180 top
JP8  19.68,80.61 0 top
JP10  45.72,9.63 180 top
JP11  83.82,9.63 180 top
L2  52.76,72.72 90 top
LED1  66.47,48.05 270 top
R1  114.12,57.96 180 bottom
R2  94.74,48.9 0 bottom
R3  31.1,17.2 0 top
R4  35.18,24.16 180 top
R5  33.17,22.49 0 bottom
R6  31.99,18.69 180 top
R7  90.27,62.87 180 bottom
R8  114.12,54.81 180 bottom
R9  35.23,24.36 180 bottom
R10  33.17,20.02 0 bottom
R11  120.45,34.9 180 top
R12  90.27,61.32 180 bottom
R13  114.12,56.39 180 bottom
R14  34.29,12.7 180 top
R15  29.54,44.74 180 top
R16  65.56,29.97 90 bottom
R17  64.24,48.9 90 top
R18  56.62,57.78 270 bottom
R19  62.05,71.33 180 bottom
RN1  26.67,15.11 180 top
U1  80.37,36.75 180 top
U$2  40.72,24.99 270 bottom
U$3  25.17,32.99 0 top
U$4  42.24,36.86 0 top
X1  11.43,25.4 270 top
X2  11.43,57.15 270 top

### Tracks (layer width: path | path; a pad name or v marks a point on that pad's centre or on a via)
5V  (via drill 0.6 pad 1.42)
  Top 0.267: R3.2 31.75,17.15 31.75,17.14
  Top 0.305: R4.2 34.53,25.89 v34.65,26.01
  Top 0.356: U$4.32 58.01,36.92 C1.1
  Top 0.406: C14.1 U1.32 | RN1.1 31.75,15.24 31.75,17.14 | C28.1 31.17,70.64 31.32,70.48 | R3.2 31.75,18.28 R6.2 | U$3.4 v24.12,35.28 v24.13,35.29
  Top 0.457: U1.32 76.91,27.23 78.11,26.04 v78.11,24.64
  Top 0.61: IC3.31 IC3.32 v100.05,24.64 99.42,24 C13.1 | R14.2 31.75,15.24 | C30.+ 93.36,59.1 93.34,59.12 | R11.2 119.1,34.9 119.08,34.92 | v27.16,44.74 R15.2 | 68.19,56.95 68.2,56.95 | v59.05,35.02 59.05,35.88 C1.1 | 74.5,56.95 74.5,58.42 | 74.5,58.42 IC7.5 | C27.1 74.51,58.43 74.5,58.42 | v24.12,35.29 v24.13,35.29 C3.1
  Top 0.66: 54.08,56.95 IC6.20 C24.1
  Top 0.813: v25.65,64.61 25.65,72.01 27.3,73.66 31.32,73.66 | v51.44,56.95 54.08,56.95 v67.74,56.95 v67.75,56.95 68.19,56.95 | 68.2,56.95 74.5,56.95 v78.11,56.95
  Top 1.067: IC5.4 31.32,70.48 31.32,73.66 31.32,76.86 C20.+ | v91.12,59.12 93.34,59.12 100.05,59.12 | 100.05,59.12 v100.05,50.8 | v117.17,24.89 119.08,26.8 119.08,34.92 v119.08,56.39 119.08,65.2 114.47,69.81 100.05,69.81 | C22.+ 94.4,86.58 100.05,80.92 100.05,69.81 | 100.05,59.12 100.05,69.81 | JP7.1 59.69,86.55
  Top 1.676: C20.+ 35.13,87.83 37.02,89.72 L2.P$2 51.88,89.72 55.06,86.55 59.69,86.55 63.12,86.55 C22.+
  Bottom 0.406: CON1.13 90.49,63.93 91.12,63.93 | CON1.38 91.12,63.93 | 91.12,63.93 R7.2 | RN1.1 31.75,15.24 | IC9.16 62.97,68.83 | 62.97,68.83 62.97,71.27 R19.2 | C2.1 62.95,68.85 62.97,68.83
  Bottom 0.61: IC4.16 v117.17,24.89 C17.1 | R7.2 R12.2 | R12.2 v91.12,59.12 | R8.2 R13.2 | R13.2 R1.2 | 31.75,26.9 C6.2 24.55,26.89 24.13,27.3 IC1.16 24.13,33.66 24.14,33.64 C11.1 | U$2.7 U$2.8 34.54,26.9 | 31.75,15.24 31.75,19.68 | 31.75,19.68 31.75,19.86 | R13.2 v119.08,56.39 | 31.75,19.86 | 31.75,19.86 R5.2 31.75,26.9 | R10.2 31.77,19.71 31.75,19.68 | R14.2 RN1.1 | R12.2 C29.1 | v51.44,56.95 56.6,56.95 R18.2 | IC9.16 62.97,65.76 67.74,60.98 v67.74,56.95 | 31.75,26.9 34.54,26.9 | v34.65,26.01 34.65,26.8 34.54,26.9
  Bottom 0.66: IC2.16 C12.1
  Bottom 0.813: v78.11,24.64 v78.11,56.95 | v100.05,24.64 v100.05,50.8 | 32.13,56.95 C9.2 27.8,60.47 25.65,62.61 v25.65,64.61 C12.1 | 32.13,56.95 v51.44,56.95 | 32.12,44.74 40.27,36.59 57.48,36.59 v59.05,35.02 | 32.12,44.74 v27.16,44.74 24.13,41.71 v24.13,35.29 24.13,33.66 | 32.12,44.74 32.12,50.16 C31.+ 32.13,56.95
!BUSACK
  Top 0.267: RN1.4 24.13,15.85
  Top 0.305: U$4.78 29.01,32.92 28.09,32 28.09,21.61 24.13,17.65 24.13,15.85
  Top 0.61: JP4.2 RN1.4
  Bottom 0.61: JP4.2 RN1.4
!BUSREQ
  Top 0.305: U$4.79 29.08,32.12 28.7,31.75 28.7,20.09 26.67,18.06 RN1.3
  Top 0.61: JP4.3 RN1.3
  Bottom 0.61: JP4.3 RN1.3
!INT
  Top 0.267: JP11.15 69.85,8.36 69.01,7.52 64.75,7.52 62.1,4.88 31.9,4.88 27.94,8.84
  Top 0.305: 27.94,8.84 27.94,18.47 32.74,23.27 32.74,30.53 33.12,30.91 35.61,30.91 35.84,30.68 U$4.4 R4.1
!IORQ
  Top 0.267: JP11.11 80.01,8.36 78.05,6.4 71.6,6.4 70.46,5.26 65.71,5.26 63.09,2.64 19.91,2.64 18.31,4.24 18.31,19.25 19.48,20.42 19.48,36.2 26.61,43.33 U$4.65
  Bottom 0.406: JP11.11 80.01,10.79 80.9,11.68 83.24,11.68 83.82,11.1 83.82,8.26 85.98,6.1 102.62,6.1 104.14,7.62 104.14,11.23 109.12,16.2 109.12,20.85 112.67,24.41 112.67,31.09 112.42,31.34 IC4.5
!IRQ1  (via drill 0.6 pad 1.42)
  Top 0.267: R3.1 30.45,17.17 30.48,17.14 v30.48,7.95
  Top 0.305: U$4.5 36.64,23.46 36.04,22.86 34.06,22.86 30.45,19.25 R3.1
  Bottom 0.406: v30.48,7.95 32.21,7.95 34.77,5.38 106.25,5.38 JP2.1
!IRQ2  (via drill 0.6 pad 1.42)
  Top 0.267: v31.7,6.73 31.7,10.92 32.87,12.09 32.87,18.85 | U$4.6 37.44,23.42 36.25,22.23 34.29,22.23 32.87,20.8 32.87,18.85 | R6.1 32.72,18.69 32.87,18.85
  Bottom 0.406: JP2.2 109.22,8.36 109.22,6.35 107.54,4.67 33.76,4.67 v31.7,6.73
!MEMEN  (via drill 0.6 pad 1.42)
  Top 0.305: U$4.66 50.93,42.52 53.11,44.7 56.49,44.7 59.16,47.37 v59.16,49.73
  Bottom 0.406: v59.16,49.73 IC9.4
!NMI
  Top 0.305: RN1.2 29.21,18.87 33.44,23.1 U$4.1
  Top 0.61: JP4.4 RN1.2
  Bottom 0.61: JP4.4 RN1.2
!RAM_CS  (via drill 0.6 pad 1.42)
  Top 0.305: U1.22 69.62,39.93 v67.36,37.67
  Bottom 0.305: R19.1 61.06,71.19 61.06,64.69 64.82,60.94 64.82,54.61 69.16,50.27 69.16,40.56 67.36,38.76 v67.36,37.67
  Bottom 0.406: D4.A D3.A D2.A R19.1
!RD  (via drill 0.6 pad 1.42)
  Top 0.267: JP11.12 77.47,8.36 76.63,7.52 71.09,7.52 69.95,6.38 65.23,6.38 62.61,3.76 23.09,3.76 19.99,6.86 19.99,18.52 21.16,19.68 21.16,35.43 25.05,39.33 U$4.70
  Top 0.305: IC3.24 85.45,36.75 84.81,37.39 U1.24
  Top 0.406: U1.24 v71.86,37.39
  Bottom 0.406: JP11.12 77.47,11.84 73,16.31 73,31.55 71.86,32.69 v71.86,37.39 71.86,59.08 72.9,60.12 72.9,68.45 74.3,69.85 85.34,69.85 86.04,69.15 CON1.34
!ROM_CS  (via drill 0.6 pad 1.42)
  Top 0.305: IC3.22 70.33,39.29 68.5,37.47 v68.5,36.35
  Bottom 0.305: IC9.15 61.7,64.92 65.43,61.19 65.43,54.86 69.77,50.52 69.77,40.31 68.5,39.04 v68.5,36.35
!RST  (via drill 0.6 pad 1.42)
  Top 0.267: JP11.17 64.77,8.36 61.85,5.44 37.67,5.44 34.98,8.13 34.98,11.51 35.36,11.89 35.36,19.66 v36.96,21.26
  Top 0.305: U$4.80 30.33,31.32 v30.33,29.97
  Top 0.406: IC6.1 54.08,53.44 54.61,53.98 v69.9,53.98
  Bottom 0.406: U$2.5 39.57,23.09 39.9,23.42 39.9,29.97 | CON1.41 94.93,70.17 93.83,71.27 73.71,71.27 70.43,68 70.43,53.98 | v30.33,29.97 39.9,29.97 | 39.9,29.97 67.13,29.97 69.75,32.59 69.75,39.34 70.43,40.03 70.43,53.98 | v69.9,53.98 70.43,53.98
  Bottom 0.61: U$2.5 36.83,23.09 | 36.83,23.09 35.19,23.09 R5.1 | v36.96,21.26 36.96,22.96 36.83,23.09
!WAIT
  Top 0.267: 21.59,17.22 RN1.5
  Top 0.305: U$4.77 28.95,33.73 27.48,32.26 27.48,23.11 21.59,17.22
  Top 0.61: JP4.1 RN1.5
  Bottom 0.61: JP4.1 RN1.5
!WR  (via drill 0.6 pad 1.42)
  Top 0.267: JP11.13 74.93,10.9 75.64,11.61 78.03,11.61 78.74,10.9 78.74,8.36 77.34,6.96 71.35,6.96 70.21,5.82 65.46,5.82 62.84,3.2 22.84,3.2 19.43,6.6 19.43,18.77 20.6,19.94 20.6,35.69 25.04,40.12 U$4.69
  Top 0.406: U1.29 v71.78,31.04 | v71.68,61.04 IC7.2
  Bottom 0.406: JP11.13 74.93,13.34 71.78,16.48 v71.78,31.04 70.46,32.36 70.46,39.06 71.14,39.75 71.14,59.38 71.68,59.92 v71.68,61.04 71.68,68.25 73.99,70.56 85.9,70.56 87.31,69.15 CON1.35
_A15
  Bottom 0.305: R16.2 65.56,37.82 68.56,40.82 68.56,50.01 60.43,58.14 IC9.3
A0  (via drill 0.6 pad 1.42)
  Top 0.267: JP10.1 54.61,8.36 52.25,5.99 37.92,5.99 35.56,8.36 35.56,10.85 36.3,11.58 37.34,11.58 39.04,13.29 U$4.8
  Top 0.305: JP10.1 54.61,10.9 55.85,12.14 104.9,12.14 114.71,21.95 114.71,36.78 112.19,39.29 109.3,39.29 | U1.12 89.97,41.2 91.03,42.27 95.78,42.27 99.26,38.79 104.27,38.79 104.78,39.29 IC3.12 109.3,39.29 | 109.3,39.29 109.3,42.98 106.35,45.92 v106.35,55.17
  Bottom 0.406: CON1.20 99.38,59.93 104.14,55.17 v106.35,55.17
A1  (via drill 0.6 pad 1.42)
  Top 0.267: JP10.2 52.07,8.36 50.27,6.55 39.27,6.55 38.1,7.72 38.1,11.38 39.84,13.12 U$4.9 | 97.38,39.93 U1.11
  Top 0.305: 97.38,39.93 99.29,38.02 IC3.11 v111.18,38.02 114.1,35.1 114.1,22.2 104.65,12.75 53.95,12.75 52.07,10.87 JP10.2
  Bottom 0.406: CON1.19 98.11,59.17 111.12,46.15 111.12,38.08 v111.18,38.02
A2  (via drill 0.6 pad 1.42)
  Top 0.267: JP10.3 49.53,8.36 48.28,7.11 41.88,7.11 40.64,8.36 40.64,29.32 U$4.10
  Top 0.305: U1.10 97.18,38.66 99.08,36.75 IC3.10 v109.96,36.75 113.49,33.22 113.49,22.45 104.39,13.36 51.89,13.36 49.53,11 JP10.3
  Bottom 0.406: v109.96,36.75 109.96,46.33 96.84,59.45 CON1.18
A3
  Top 0.267: JP10.4 46.99,8.48 46.18,7.67 43.87,7.67 43.18,8.36 43.18,10.92 41.44,12.66 U$4.11
  Top 0.305: U1.9 97.59,37.39 98.83,36.14 105.44,36.14 106.1,35.48 IC3.9 109.27,35.48 112.88,31.88 112.88,22.71 104.14,13.97 50.06,13.97 46.99,10.9 JP10.4
A4
  Top 0.305: U1.8 97.99,36.12 98.58,35.53 104.78,35.53 106.1,34.21 IC3.8 109.27,34.21 112.27,31.22 112.27,22.96 103.89,14.58 49.43,14.58 45.64,10.79 44.45,10.79 | JP10.5 44.45,10.79 | 44.45,10.79 44.45,18.85 43.04,20.26 U$4.13
A5  (via drill 0.6 pad 1.42)
  Top 0.305: U1.7 104.19,34.85 106.1,32.94 IC3.7 109.04,32.94 111.02,30.96 v111.02,24.59 111.02,22.58 103.63,15.19 v47.7,15.19 47.7,18.39 44.64,21.45 U$4.15
  Bottom 0.406: v111.02,24.59 IC4.1 | v47.7,15.19 45.67,15.19 41.91,11.43 JP10.6
A6  (via drill 0.6 pad 1.42)
  Top 0.305: U1.6 103.56,33.58 105.46,31.67 IC3.6 108.58,31.67 109.27,30.99 109.27,29.23 108.69,28.65 v108.69,24.59 108.69,21.11 103.38,15.8 49.55,15.8 v48.95,16.41 48.95,18.01 45.44,21.51 U$4.16
  Bottom 0.406: JP10.7 39.37,11.43 44.35,16.41 v48.95,16.41 | IC4.2 109.55,27.53 108.69,26.67 v108.69,24.59
A7  (via drill 0.6 pad 1.42)
  Top 0.305: U1.5 103.07,32.31 104.98,30.4 106.35,30.4 | 106.35,30.4 v106.35,24.59 106.35,21.08 101.68,16.41 51.41,16.41 v50.19,17.63 46.24,21.58 U$4.17 | 106.35,30.4 IC3.5
  Bottom 0.406: IC4.3 109.12,28.8 106.35,26.04 v106.35,24.59 | JP10.8 36.83,10.54 43.92,17.63 v50.19,17.63
A8  (via drill 0.6 pad 1.42)
  Top 0.267: v105.18,21.59 100.58,16.99 52.45,16.99 47.04,22.4 U$4.18 | IC3.27 103.33,32.94 105.23,31.04 108.38,31.04 108.69,30.73 108.69,29.49 107.52,28.32 v107.52,21.59
  Top 0.305: U1.27 84.81,33.58 85.45,32.94 IC3.27
  Bottom 0.406: v105.18,21.59 v107.52,21.59
A9  (via drill 0.6 pad 1.42)
  Top 0.267: v105.18,23.32 99.42,17.55 52.7,17.55 47.84,22.42 U$4.19
  Top 0.305: U1.26 84.81,34.85 85.45,34.21 IC3.26 103.81,34.21 105.72,32.31 108.81,32.31 109.88,31.24 109.88,22.71 v109.86,23.32
  Bottom 0.406: v105.18,23.32 v109.86,23.32
A10  (via drill 0.6 pad 1.42)
  Top 0.267: v66.93,18.69 66.34,18.11 52.96,18.11 48.64,22.43 U$4.20
  Top 0.305: U1.23 84.81,38.66 85.45,38.02 IC3.23
  Top 0.406: v66.93,27.03 67.94,28.04 67.94,31.19 70.46,33.71 70.46,37.9 71.22,38.66 U1.23
  Bottom 0.406: v66.93,18.69 v66.93,27.03
A11  (via drill 0.6 pad 1.42)
  Top 0.267: v68.66,18.69 67.51,19.84 66.45,19.84 65.28,18.67 53.21,18.67 49.44,22.44 U$4.21
  Top 0.305: U1.25 84.81,36.12 85.45,35.48 IC3.25
  Top 0.406: v68.66,27.03 68.66,30.89 71.86,34.09 71.86,35.71 72.26,36.12 U1.25
  Bottom 0.406: v68.66,18.69 v68.66,27.03
A12
  Top 0.267: IC3.4 105.13,24.89 99.03,18.8 70.18,18.8 68.58,20.4 66.19,20.4 65.56,19.76 54.84,19.76 51.84,22.76 U$4.24
  Top 0.305: IC3.4 105.13,29.34 103.43,31.04 U1.4
A13  (via drill 0.6 pad 1.42)
  Top 0.267: v70.28,20.32 69.65,20.95 65.94,20.95 65.3,20.32 59.38,20.32 56.52,23.19 56.52,31.04 56.23,31.32 U$4.25
  Top 0.305: U1.28 84.81,32.31 85.45,31.67 IC3.28
  Top 0.406: v70.28,29.84 70.28,31.27 71.32,32.31 U1.28
  Bottom 0.406: v70.28,29.84 v70.28,20.32
A14  (via drill 0.6 pad 1.42)
  Top 0.267: v92,19.94 72.29,19.94 70.71,21.51 65.68,21.51 65.05,20.88 59.61,20.88 57.07,23.42 57.07,31.65 56.6,32.12 U$4.26
  Top 0.305: U1.3 v91.19,29.77 91.82,30.4 IC3.29
  Bottom 0.406: v92,19.94 92,28.96 v91.19,29.77
A15  (via drill 0.6 pad 1.42)
  Top 0.267: v63.93,22.1 62,22.1 61.34,21.44 59.87,21.44 57.63,23.67 57.63,32.31 57.02,32.92 U$4.27
  Top 0.305: IC3.3 103.86,24.69 101.4,22.23 96.04,22.23 92.66,25.6 86.16,25.6 83.26,28.5 U1.31 72.26,28.5 70.99,27.23 70.99,26.04 69.24,24.28 67.46,24.28 66.9,23.72 v65.56,23.72
  Bottom 0.406: v63.93,22.1 v65.56,23.72 R16.1
A16  (via drill 0.6 pad 1.42)
  Top 0.267: v89.56,22.58 86.72,22.58 | 71.25,22.58 65.08,22.58 64.41,23.24 62.33,23.24 61.09,22 60.12,22 58.19,23.93 58.19,32.56 57.03,33.73 U$4.28
  Top 0.305: IC3.2 102.59,29.57 101.73,30.43 98.53,30.43 98.15,30.05 98.15,27.18 97.69,26.72 93.29,26.72 92.08,27.94 v89.56,27.94 89.48,27.94 88.92,28.5 U1.2 | 71.25,22.58 86.72,22.58
  Bottom 0.406: v89.56,22.58 v89.56,27.94
A17  (via drill 0.6 pad 1.42)
  Top 0.305: 97.51,29.13 IC3.30 | 97.51,28.73 IC3.30 | 97.51,28.6 IC3.30 | IC3.30 97.51,29.34 92.73,29.34 92,28.6 90.55,28.6 90.02,29.13 85.45,29.13 84.81,29.77 U1.30 71.86,29.77 69.83,27.74 69.83,26.54 68.73,25.45 v60.6,25.45 | v60.6,23.14 60.43,23.14 58.78,24.79 58.78,32.82 57.07,34.52 U$4.29
  Bottom 0.406: v60.6,23.14 v60.6,25.45
A18
  Top 0.267: U1.1 85.72,27.23 83.84,29.11 72.03,29.11 70.41,27.48 70.41,26.29 68.99,24.87 65.05,24.87 64.49,24.31 60.12,24.31 59.36,25.07 59.36,33.07 56.3,36.12 U$4.31
  Top 0.305: IC3.1 101.32,23.62 100.53,22.84 96.32,22.84 92.38,26.77 88.8,26.77 88.34,27.23 U1.1
CF_CS0
  Bottom 0.305: 109.22,33.25 114.53,33.25 115.16,33.88 IC4.10
  Bottom 0.406: CON1.7 82.87,60.64 87.63,55.88 98.37,55.88 108,46.25 108,34.47 109.22,33.25
CLK
  Top 0.267: JP11.16 67.31,10.9 67.94,11.53 70.48,11.53 71.12,10.9 71.12,8.36 69.7,6.93 64.97,6.93 62.36,4.32 23.34,4.32 20.55,7.11 20.55,18.26 21.72,19.43 21.72,35.18 25.06,38.52 U$4.71
CS2
  Bottom 0.305: IC4.13 118.52,30.07 119.33,29.26 119.33,21.08 114.3,16.05 114.3,8.36 JP2.5
CS3
  Bottom 0.305: JP2.6 113.03,21.16 115.27,23.39 115.27,30.81 115.8,31.34 IC4.12
CS4
  Bottom 0.305: JP2.3 111.76,8.36 111.76,20.73 114.66,23.62 114.66,31.47 115.8,32.61 IC4.11
CTS1  (via drill 0.6 pad 1.42)
  Top 0.305: v15.24,65.41 17.04,67.21 19.13,67.21 20.83,65.51 20.83,53.92 23.47,51.28 44.65,51.28 47.84,48.1 U$4.46
  Bottom 0.406: IC2.9 v15.24,65.41
CTS2  (via drill 0.6 pad 1.42)
  Top 0.305: v15.24,33.93 15.24,38.73 17.27,40.77 20.04,40.77 27.51,48.23 38.63,48.23 39.04,47.83 U$4.57
  Bottom 0.406: IC1.9 v15.24,33.93
D0  (via drill 0.6 pad 1.42)
  Top 0.305: v105.18,57.63 105.18,46.23 107.02,44.39 IC3.13 105.18,40.56 104.01,39.4 99.69,39.4 98.15,40.95 98.15,45.97 96.7,47.42 94.26,47.42 93.98,47.14 93.98,45.44 93.29,44.76 91.8,44.76 89.51,42.47 U1.13 83.86,42.47 83.22,43.1 66.47,43.1 64.62,41.25 62.59,41.25 60.66,39.33 | U$4.35 60.66,39.33 | v61.7,27.51 61.7,38.29 60.66,39.33
  Bottom 0.406: v61.7,27.51 61.7,19.02 63.25,17.48 69.77,17.48 73.66,13.59 73.66,8.08 74.22,7.52 81.81,7.52 82.55,8.26 JP11.10 | CON1.21 100.65,60.69 103.71,57.63 v105.18,57.63
D1  (via drill 0.6 pad 1.42)
  Top 0.305: v103.99,60.1 104.01,57.15 104.57,56.59 104.57,44.91 105.13,44.35 IC3.14 105.13,41.38 103.76,40.01 100.38,40.01 99.42,40.97 99.42,46.43 97.21,48.64 93.09,48.64 v91.59,47.14 91.59,46.28 89.05,43.74 U1.14 84.49,43.74 83.86,44.37 66.02,44.37 65.25,43.61 62.81,43.61 59.33,40.12 U$4.36
  Bottom 0.406: JP11.9 85.09,8.26 86.54,6.81 92.46,6.81 93.98,8.33 93.98,12.7 93.22,13.46 93.22,20.45 92.71,20.95 92.71,29.97 90.6,32.08 90.6,46.15 v91.59,47.14 | CON1.22 101.92,62.17 v103.99,60.1
D2  (via drill 0.6 pad 1.42)
  Top 0.305: v105.73,60.1 104.56,61.27 103.5,61.27 102.82,60.58 102.82,57.48 103.86,56.44 IC3.15 103.86,41.38 103.1,40.62 101.04,40.62 100.69,40.97 100.69,46.89 97.71,49.86 89.38,49.86 v89.18,49.66 89.23,49.61 89.23,45.64 88.59,45.01 U1.15 85.13,45.01 84.49,45.64 66.02,45.64 65.48,46.18 64.52,46.18 59.26,40.92 U$4.37
  Bottom 0.406: JP11.8 87.63,8.03 88.14,7.52 90.7,7.52 91.44,8.26 91.44,11.58 88.34,14.68 88.34,29.08 88.85,29.59 88.85,49.33 v89.18,49.66 | CON1.23 103.19,62.64 v105.73,60.1
D3  (via drill 0.6 pad 1.42)
  Top 0.305: IC3.17 101.32,47.12 97.61,50.83 88.67,50.83 87.63,49.78 v87.63,48.41 88.62,47.42 88.62,46 88.27,45.64 85.45,45.64 84.81,46.28 U1.17 66.24,46.28 65.73,46.79 64.26,46.79 59.2,41.73 U$4.38
  Bottom 0.406: JP11.7 90.17,11.84 87.63,14.38 87.63,29.36 88.14,29.87 88.14,47.35 87.63,47.85 v87.63,48.41 87.63,50.42 76.52,61.53 CON1.2
D4  (via drill 0.6 pad 1.42)
  Top 0.305: IC3.18 100.05,46.66 97.46,49.25 91.24,49.25 v90.4,48.41 90.4,45.95 88.82,44.37 84.81,44.37 84.18,45.01 U1.18 v65,45.01 | U$4.39 58.32,42.52 v60.81,45.01
  Top 0.406: IC6.8 62.97,47.17 v60.81,45.01
  Bottom 0.406: JP11.6 92.71,12.06 90.78,13.99 90.78,28.45 89.56,29.67 89.56,47.57 v90.4,48.41 90.4,50.16 89.69,50.88 88.19,50.88 77.79,61.28 CON1.3 | v60.81,45.01 v65,45.01
D5  (via drill 0.6 pad 1.42)
  Top 0.305: IC3.19 98.78,46.2 96.95,48.03 93.75,48.03 92.81,47.09 v92.81,45.92 92.46,45.57 91.75,45.57 89.28,43.1 84.18,43.1 83.54,43.74 U1.19 66.24,43.74 64.92,42.42 v63.27,42.42 | U$4.40 57.37,43.33 v59.05,45.01
  Top 0.406: IC6.7 61.7,47.65 v59.05,45.01
  Bottom 0.305: v63.27,42.42 61.65,42.42 v59.05,45.01
  Bottom 0.406: JP11.5 95.25,12.7 93.93,14.02 93.93,20.75 93.42,21.26 93.42,30.28 91.31,32.38 91.31,44.42 v92.81,45.92 92.81,48.77 89.99,51.59 88.49,51.59 79.06,61.02 CON1.4
D6  (via drill 0.6 pad 1.42)
  Top 0.267: 52.06,46.52 51.84,46.52 U$4.41
  Top 0.305: 97.51,41.83 IC3.20 97.51,42.88 | 97.51,42.88 97.51,45.62 96.85,46.28 v95.28,46.28 | 97.51,42.88 90.78,42.88 89.74,41.83 83.54,41.83 82.91,42.47 U1.20 66.7,42.47 v63.55,39.32 | 51.84,45.01 U$4.41 | v53.67,46.52 52.06,46.52
  Top 0.406: IC6.4 57.89,47.24 57.16,46.52 v53.67,46.52
  Bottom 0.305: v63.55,39.32 58.8,39.32 53.67,44.45 v53.67,46.52
  Bottom 0.406: 94.74,46.35 94.74,45.14 93.75,44.15 93.75,31.98 94.84,30.89 94.84,21.87 95.35,21.36 95.35,14.86 97.79,12.42 JP11.4 | CON1.5 80.33,60.74 88.77,52.3 92.58,52.3 94.74,50.14 94.74,46.35 | v95.28,46.28 94.84,46.25 94.74,46.35
D7  (via drill 0.6 pad 1.42)
  Top 0.305: 92.48,40.56 85.45,40.56 84.81,41.2 U1.21 v67.08,41.2 | 92.48,40.56 IC3.21 | v92.53,41.12 92.53,40.62 92.48,40.56 | U$4.44 49.44,47.94 49.84,48.34 v56.62,48.34
  Top 0.406: IC6.3 v56.62,48.34
  Bottom 0.305: v56.62,48.34 56.62,45.8 61.21,41.2 v67.08,41.2
  Bottom 0.406: JP11.3 100.33,8.26 99.59,7.52 97.26,7.52 96.52,8.26 96.52,12.7 94.64,14.58 94.64,21.06 94.13,21.57 94.13,30.58 92.53,32.18 v92.53,41.12 92.53,43.92 94.03,45.41 94.03,48.76 R2.2
E  (via drill 0.6 pad 1.42)
  Top 0.267: U$4.67 25.82,41.73 20.04,35.94 20.04,20.19 18.87,19.02 18.87,5.31 v20.22,3.96
  Bottom 0.406: v20.22,3.96 107.85,3.96 109.7,5.82 114.3,5.82 JP2.7
EXTAL
  Top 0.305: U$3.3 28.11,33.82 28.81,34.52 U$4.76
GND  (via drill 0.6 pad 1.42)
  Bottom 0.406: 75.25,63.82 CON1.1 75.25,68.87 | 84.15,68.83 84.14,68.87 CON1.8 84.14,63.56 84.99,62.71 | 85.39,63.7 85.41,63.72 CON1.9 85.41,68.8 85.06,69.14 | CON1.10 86.68,63.79 | 88.16,63.12 87.95,63.34 CON1.11 87.95,69.6 87.94,69.62 | CON1.12 89.22,69.6 89.23,69.39 | 91.76,69.6 CON1.14 91.76,63.97 | 93.03,69.6 CON1.15 93.03,63.77 93.02,63.75 | 92.39,69.6 CON1.39 92.39,63.72 92.38,63.7 | 94.3,69.6 CON1.16 94.3,63.72 | 95.57,63.69 CON1.17 95.57,69.6 | 106.36,63.74 CON1.50 106.36,69.6
  other vias: 41.81,54.58 109.22,13.34 24.08,69.22 15.88,48.9 102.59,46.28 25.6,30.63 14.61,7.62 66.78,49.81 60.12,38 30.3,28.22 85.45,48.41 97.59,20.5 53.52,25.86 75.74,24.64 96.7,25.37 51.54,65.63 114.63,19.58 26.67,6.35 95.45,63.25 87.73,59.87 33.02,71.12 27.3,69.22 60.33,82.52 31.11,87.6 75.92,48.41 114.6,39.7 115.14,49.35 96.82,53.04 116.92,73.99 121.13,73.99 121.59,39.7 58.42,9.53 50.62,25.88 45.85,13.16 27.61,37.34 63.3,34.82 20.6,39.42 63.8,27.51 69.14,59.39 67.74,34.19
  pour Bottom (isolate 0.305, rank 2, no thermals): 0,94.61 0,0 126.36,0 126.36,94.61
  pour Top (isolate 0.305, rank 2, no thermals): 126.36,94.61 0,94.61 0,75 5,75 5,8 0,8 0,0 126.36,0
LOCAL_PORT_CS  (via drill 0.6 pad 1.42)
  Top 0.406: IC7.1 85.63,60.09 v87.81,57.91
  Bottom 0.406: IC4.7 109.6,33.88 108.71,34.77 108.71,46.56 98.68,56.59 89.13,56.59 v87.81,57.91
N$1
  Bottom 0.406: X2.7 10.16,57.86 12.17,55.85 15.27,55.85 16.51,54.61 IC2.7
N$2
  Bottom 0.61: IC2.1 24.13,51.22 C7.2
N$3
  Bottom 0.61: IC2.4 20.32,48.91 C8.2
N$4
  Bottom 0.61: IC2.5 19.05,50.19 18.68,49.82 C8.1
N$5
  Bottom 0.61: IC2.3 21.59,51.22 C7.1
N$6
  Bottom 0.61: IC2.2 22.86,55.88 23.93,56.95 C9.1
N$7
  Bottom 0.406: X1.7 10.16,26.14 12.27,24.03 15.34,24.03 16.51,22.86 IC1.7
N$8
  Bottom 0.406: X1.2 19.25,28.14 20.32,29.21 IC1.13
N$9
  Bottom 0.61: IC1.1 24.13,19.47 C4.2
N$10
  Bottom 0.61: IC1.4 20.32,17.31 C5.2
N$11
  Bottom 0.61: IC1.5 19.05,18.41 18.68,18.05 C5.1
N$12
  Bottom 0.61: IC1.3 21.59,19.47 C4.1
N$13
  Bottom 0.61: IC1.2 22.86,24.13 23.91,25.18 C6.1
N$14
  Bottom 0.61: IC1.6 17.78,19.05 C25.1
N$15
  Bottom 0.406: X2.2 19.25,59.89 20.32,60.96 IC2.13
N$16
  Bottom 0.406: X2.3 19.05,57.15 21.59,59.69 IC2.14
N$17
  Bottom 0.406: X2.8 10.16,55.12 12.19,53.09 15.24,53.09 IC2.8
N$18
  Bottom 0.406: X1.3 19.05,25.4 21.59,27.94 IC1.14
N$19
  Bottom 0.61: IC2.6 17.78,51.04 C10.1
N$20
  Bottom 1.676: JP8.1 13.8,80.61 J2.PWR
N$21
  Bottom 0.813: B1.AC1 F1.2
N$22  (via drill 0.6 pad 1.78)
  Top 0.813: C23.1 v39.6,68.66
  Top 1.067: IC5.1 v39.6,68.66 | C21.+
  Top 1.27: v39.6,68.66 C21.+
  Bottom 0.813: B1.+ 36.14,78.79 39.6,75.34 v39.6,68.66
N$23
  Top 1.067: IC5.2 D1.C
  Top 1.676: D1.C 45.25,73.71 L2.P$1
N$24
  Bottom 0.813: B1.AC2 16.56,76.25 15.28,74.97 J2.GND@2
  Bottom 1.27: J2.GND@1 7.5,76.32 8.89,74.93 10.76,74.93 J2.GND@2
N$25
  Top 0.305: U$4.59 37.44,43.97 37.16,43.69 33.2,43.69 32.15,44.74 R15.1
N$26  (via drill 0.6 pad 1.42)
  Top 0.61: v121.3,33.25 R11.1
  Bottom 0.305: IC4.6 114.83,32.61 115.47,33.25 v121.3,33.25
N$27
  Bottom 0.406: CON1.44 98.74,59.55 104.34,53.95 112.41,53.95 R8.1
N$28
  Bottom 0.406: IC1.8 15.24,21.27 12.28,21.27 10.16,23.39 X1.8
N$29
  Bottom 0.406: CON1.36 88.58,63.7 R7.1
N$30
  Bottom 0.406: CON1.46 101.28,61.07 103.5,58.85 112.38,58.85 R1.1
N$31
  Bottom 0.406: R12.1 85.37,61.32 83.5,63.18 CON1.32
N$32
  Bottom 0.61: JP6.1 R13.1
N$33
  Bottom 0.406: CON1.45 100.01,60.31 103.94,56.39 JP6.2
N$34
  Bottom 0.406: CON1.6 81.6,60.49 89.08,53.01 92.89,53.01 95.59,50.31 R2.1
N$35
  Bottom 0.61: U$2.6 R9.2
N$36
  Bottom 0.61: U$2.3 C18.1
N$37
  Bottom 0.61: U$2.1 C19.1
N$38
  Bottom 0.406: U$2.2 41.07,25.63 40.62,25.17 40.62,22.84 37.8,20.02 36.63,20.02 | R10.1 36.63,20.02 | 36.63,20.02 JP5.2
N$39
  Bottom 0.813: JP8.2 F1.1
N$40  (via drill 0.6 pad 1.27)
  other vias: 5,5
N$41  (via drill 0.6 pad 1.27)
  other vias: 121.36,5
N$42  (via drill 0.6 pad 1.27)
  other vias: 5,89.61
N$43  (via drill 0.6 pad 1.27)
  other vias: 121.36,89.61
N$44
  Top 0.406: IC7.4 74.13,61.99 73.84,62.28 65.51,62.28 IC6.11
N$46
  Top 0.66: R17.2 IC6.9
N$47
  Top 0.406: LED1.A R17.1
N$48
  Bottom 0.406: R18.1 IC9.6
N$49
  Bottom 0.406: IC9.13 D2.C
N$50
  Bottom 0.406: IC9.9 D4.C
N$51
  Bottom 0.406: IC9.11 D3.C
ROMSHADOW  (via drill 0.6 pad 1.42)
  Top 0.406: IC6.6 v60.43,48.56
  Bottom 0.305: v60.43,48.56 60.43,50.57 59.79,51.21 59.79,61.95 60.07,62.23 61.44,62.23 61.7,61.98 IC9.2
RTS1  (via drill 0.6 pad 1.42)
  Top 0.305: v16.51,68.33 18.87,68.33 21.44,65.76 21.44,54.18 23.72,51.89 44.91,51.89 48.64,48.16 U$4.45
  Bottom 0.406: IC2.10 v16.51,68.33
RTS2  (via drill 0.6 pad 1.42)
  Top 0.305: v27.25,53.06 44.6,53.06 48.08,49.58 54.41,49.58 55.35,50.52 IC6.2
  Bottom 0.406: IC1.10 16.51,43.81 17.14,44.45 21.59,44.45 27.3,50.16 27.3,51.74 v27.25,53.06
RXD1  (via drill 0.6 pad 1.42)
  Top 0.305: v19.05,64.77 19.05,53.98 22.96,50.06 44.15,50.06 45.44,48.77 U$4.49
  Bottom 0.406: IC2.12 v19.05,64.77
RXD2  (via drill 0.6 pad 1.42)
  Top 0.305: v19.05,41.94 20.34,41.94 27.25,48.84 40.92,48.84 41.44,48.32 U$4.54
  Bottom 0.406: IC1.12 v19.05,41.94
ST
  Top 0.305: U$4.7 38.24,14.11 R14.1
TXD1  (via drill 0.6 pad 1.42)
  Top 0.305: v17.78,66.04 19.43,66.04 20.22,65.25 20.22,53.67 23.22,50.67 44.4,50.67 46.24,48.83 U$4.48
  Bottom 0.406: IC2.11 v17.78,66.04
TXD2  (via drill 0.6 pad 1.42)
  Top 0.305: v17.78,43.13 20.65,43.13 26.98,49.45 41.86,49.45 43.04,48.27 U$4.52
  Bottom 0.406: IC1.11 v17.78,43.13